# Altium project S7CAS-PLEIADES-CARTE-MERE_P06.PrjPcb (part 2 of 4)

## Sheet S7CAS-PLEIADES-CARTE-MERE_P06_FPGA2.SCHDOC
size Tabloid; SheetNumber: 7; SheetTotal: 18; Sheet_Name: FPGA2; Size: 11x17
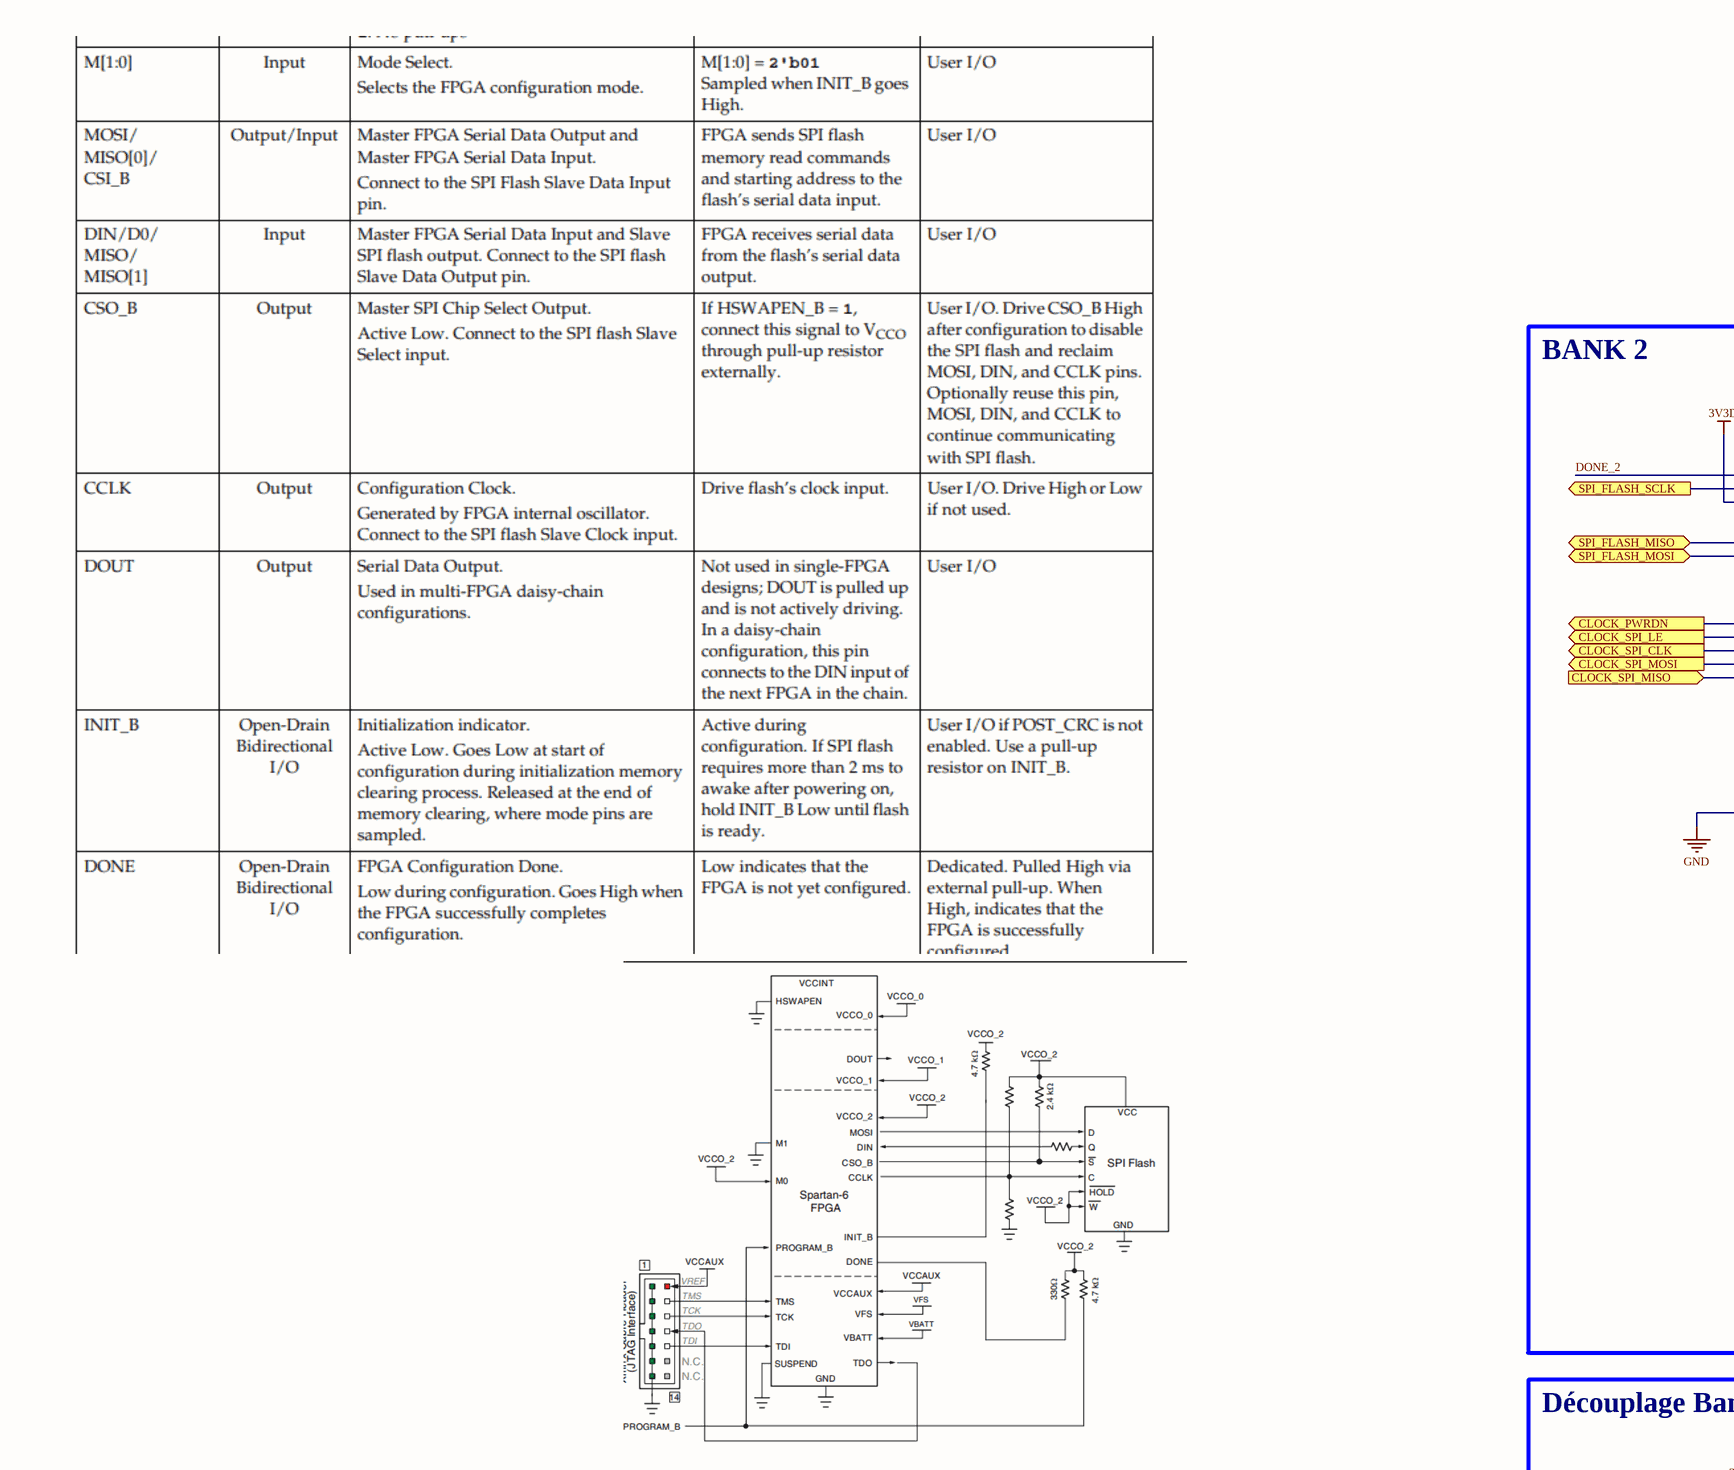
[diagram p11: S7CAS-PLEIADES-CARTE-MERE_P06_FPGA2.SCHDOC, top left]
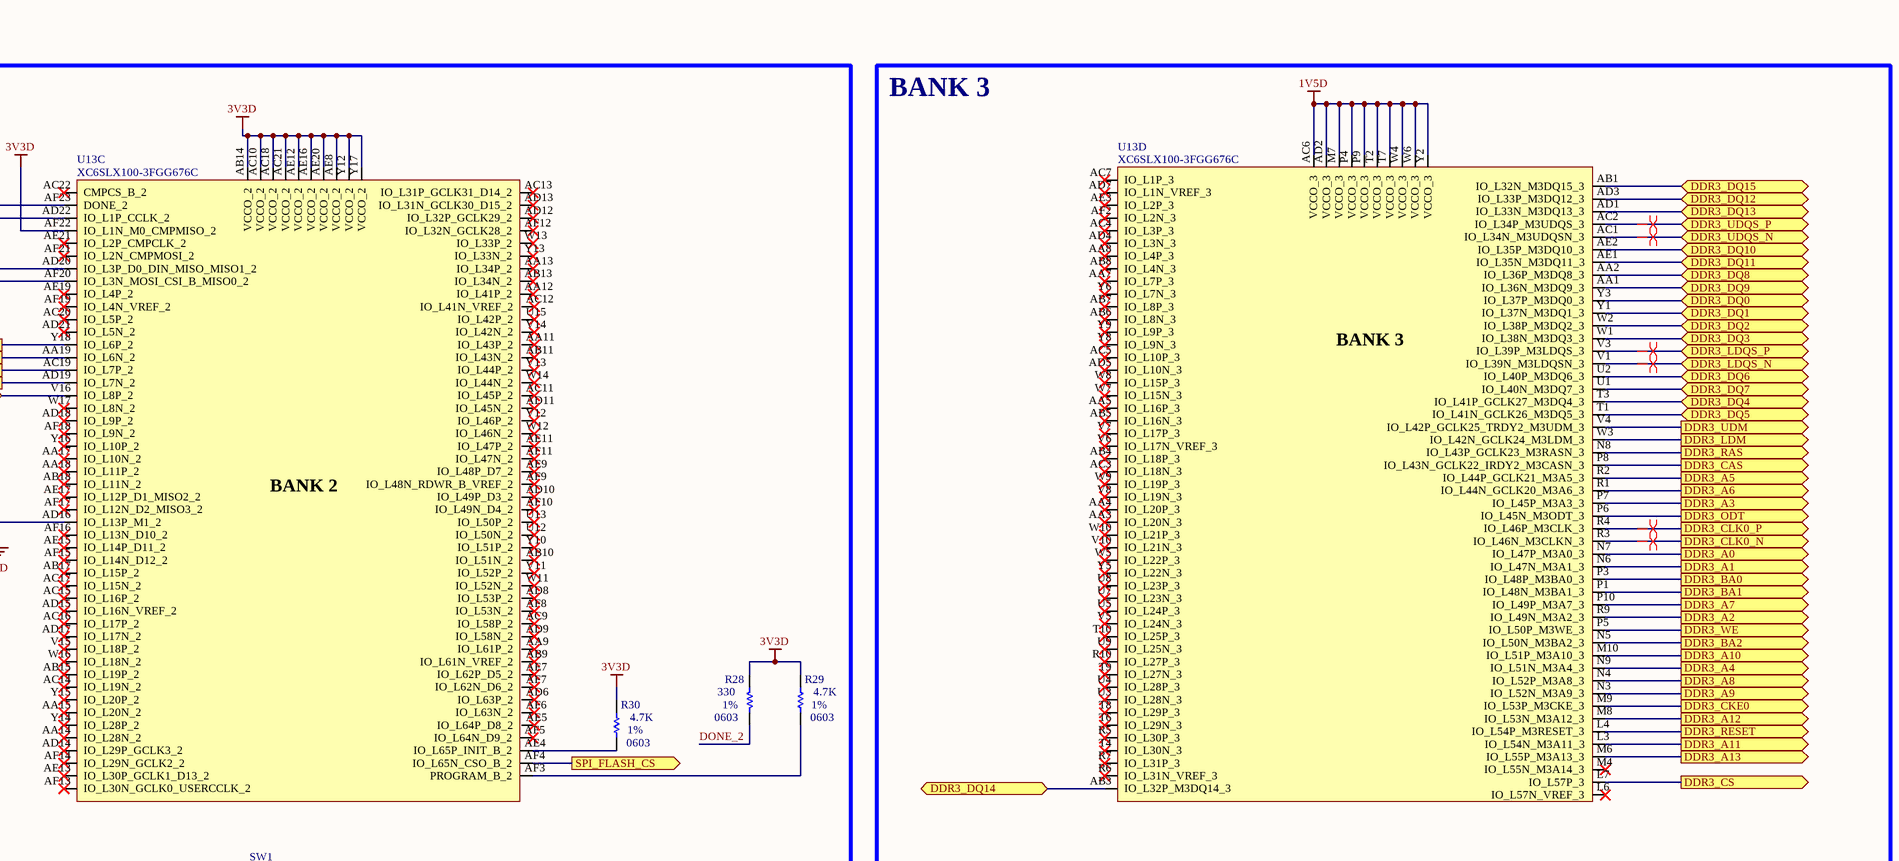
[diagram p12: S7CAS-PLEIADES-CARTE-MERE_P06_FPGA2.SCHDOC, top right]
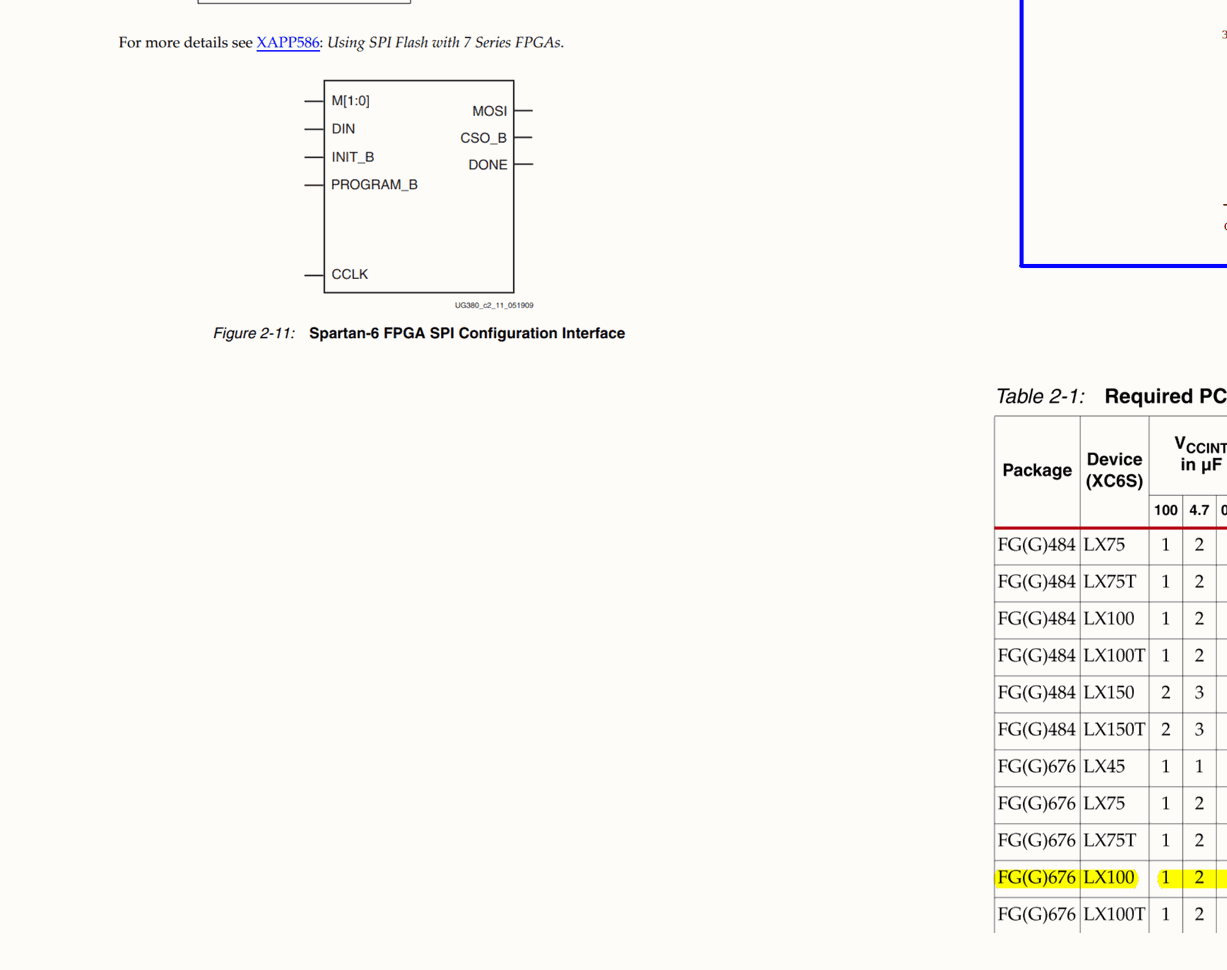
[diagram p13: S7CAS-PLEIADES-CARTE-MERE_P06_FPGA2.SCHDOC, bottom left]
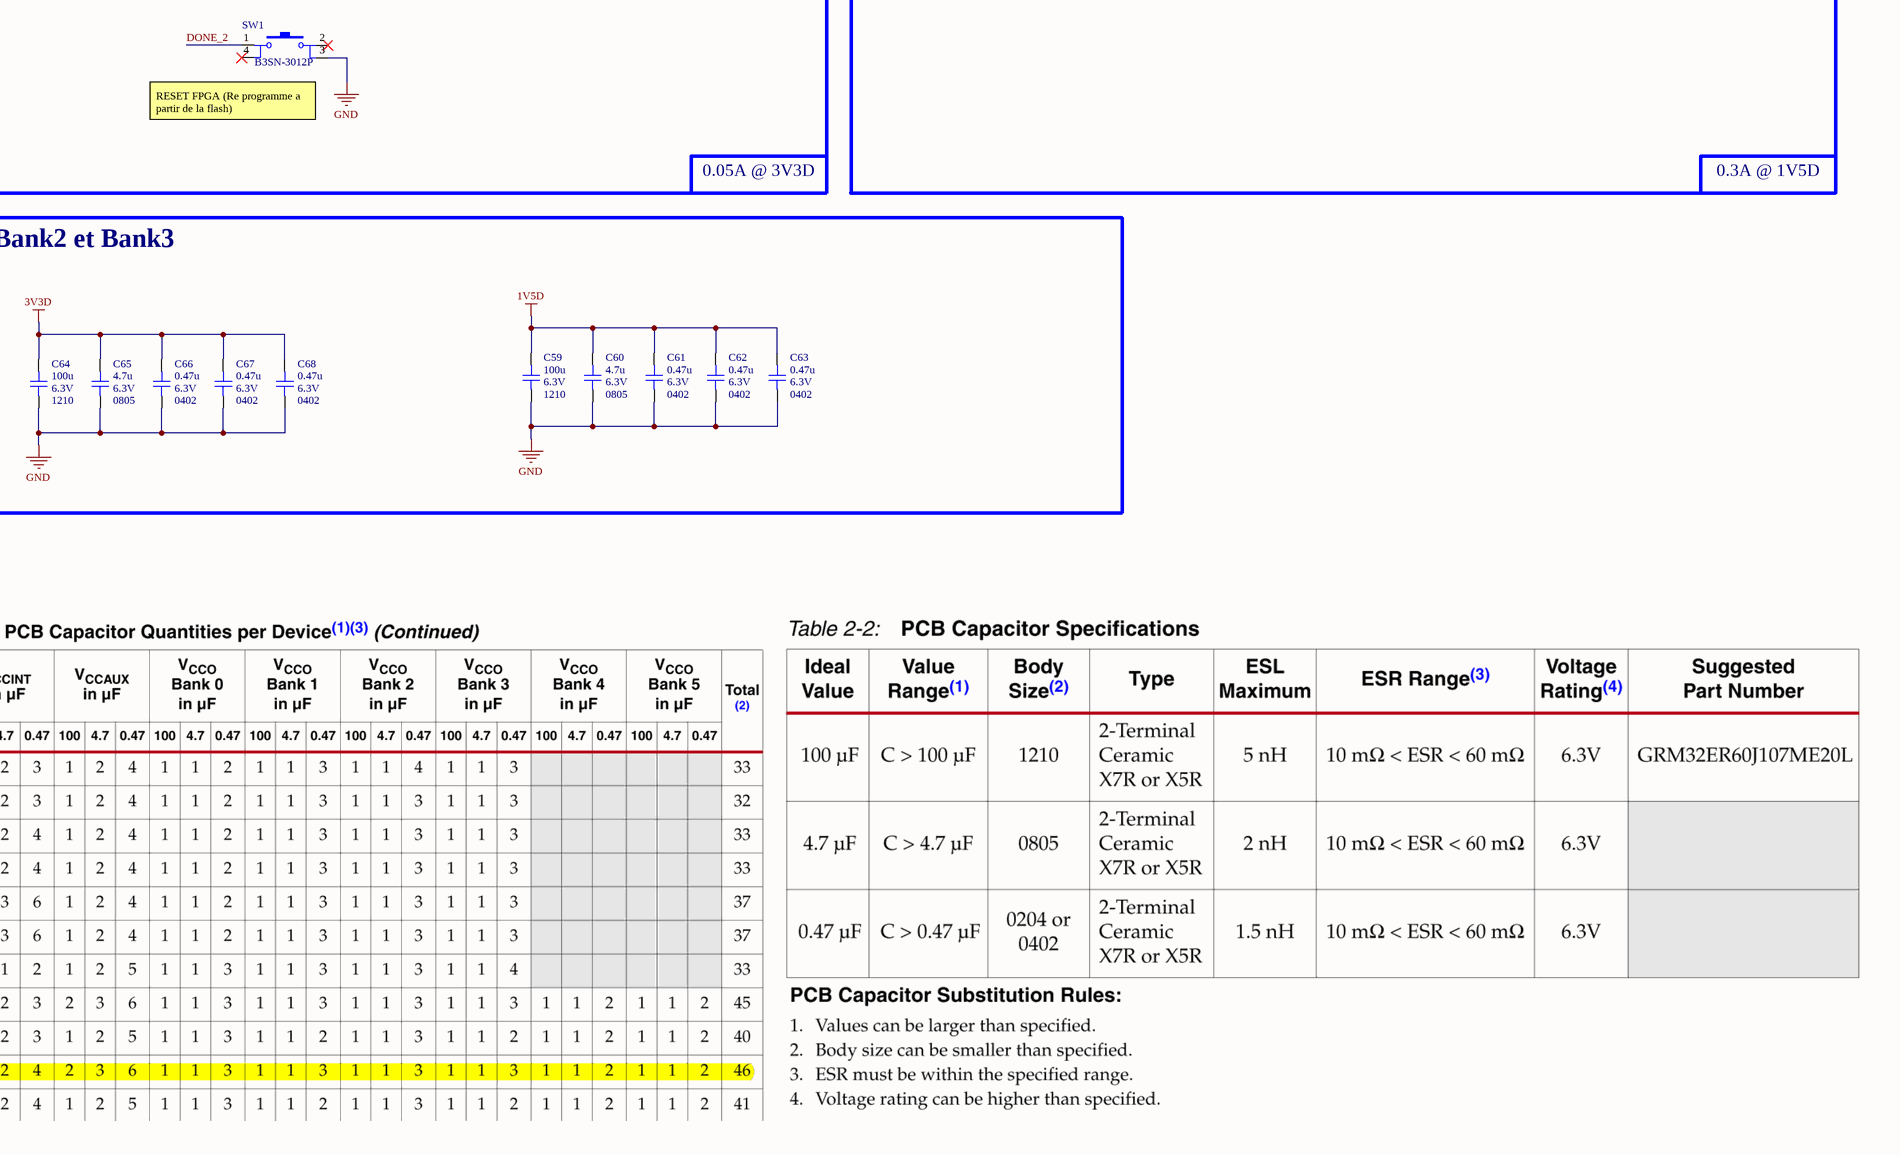
[diagram p14: S7CAS-PLEIADES-CARTE-MERE_P06_FPGA2.SCHDOC, bottom right]

### Parts
C59  value 100u  Voltage: 6.3V  Package: 1210  [CAP_1210]  (hidden comment: CAP - 1210)
C60  value 4.7u  Voltage: 6.3V  Package: 0805  [CAP_0805]  (hidden comment: CAP - 0805)
C61  value 0.47u  Voltage: 6.3V  Package: 0402  [CAP_0402]  (hidden comment: CAP - 0402)
C62  value 0.47u  Voltage: 6.3V  Package: 0402  [CAP_0402]  (hidden comment: CAP - 0402)
C63  value 0.47u  Voltage: 6.3V  Package: 0402  [CAP_0402]  (hidden comment: CAP - 0402)
C64  value 100u  Voltage: 6.3V  Package: 1210  [CAP_1210]  (hidden comment: CAP - 1210)
C65  value 4.7u  Voltage: 6.3V  Package: 0805  [CAP_0805]  (hidden comment: CAP - 0805)
C66  value 0.47u  Voltage: 6.3V  Package: 0402  [CAP_0402]  (hidden comment: CAP - 0402)
C67  value 0.47u  Voltage: 6.3V  Package: 0402  [CAP_0402]  (hidden comment: CAP - 0402)
C68  value 0.47u  Voltage: 6.3V  Package: 0402  [CAP_0402]  (hidden comment: CAP - 0402)
R28  value 330  Package: 0603  Precision: 1%  [RES_0603]  (hidden comment: RES - 0603)
R29  value 4.7K  Package: 0603  Precision: 1%  [RES_0603]  (hidden comment: RES - 0603)
R30  value 4.7K  Package: 0603  Precision: 1%  [RES_0603]  (hidden comment: RES - 0603)
SW1  B3SN-3012P  [SWI_TACT_B3SN-3012P]
U13  XC6SLX100-3FGG676C  [FPGA_XILINX_FGG676]  (parts C,D of 10)

### Blocks framed on the sheet
BANK 2: R28-R30 SW1 U13
BANK 3: U13
Découplage Bank2 et Bank3: C59-C68

### Ports
CLOCK_PWRDN (out, see S7CAS-PLEIADES-CARTE-MERE_P06_CLOCK[4B]), CLOCK_SPI_CLK (out, see S7CAS-PLEIADES-CARTE-MERE_P06_CLOCK[5B]), CLOCK_SPI_LE (out, see S7CAS-PLEIADES-CARTE-MERE_P06_CLOCK[5B]), CLOCK_SPI_MISO (in, see S7CAS-PLEIADES-CARTE-MERE_P06_CLOCK[5B]), CLOCK_SPI_MOSI (out, see S7CAS-PLEIADES-CARTE-MERE_P06_CLOCK[5B]), DDR3_A0 (out, see S7CAS-PLEIADES-CARTE-MERE_P06_DDR3[1B]), DDR3_A1 (out, see S7CAS-PLEIADES-CARTE-MERE_P06_DDR3[1B]), DDR3_A2 (out, see S7CAS-PLEIADES-CARTE-MERE_P06_DDR3[1B]), DDR3_A3 (out, see S7CAS-PLEIADES-CARTE-MERE_P06_DDR3[1B]), DDR3_A4 (out, see S7CAS-PLEIADES-CARTE-MERE_P06_DDR3[1B]), DDR3_A5 (out, see S7CAS-PLEIADES-CARTE-MERE_P06_DDR3[1B]), DDR3_A6 (out, see S7CAS-PLEIADES-CARTE-MERE_P06_DDR3[1B]), DDR3_A7 (out, see S7CAS-PLEIADES-CARTE-MERE_P06_DDR3[1B]), DDR3_A8 (out, see S7CAS-PLEIADES-CARTE-MERE_P06_DDR3[1B]), DDR3_A9 (out, see S7CAS-PLEIADES-CARTE-MERE_P06_DDR3[1B]), DDR3_A10 (out, see S7CAS-PLEIADES-CARTE-MERE_P06_DDR3[1B]), DDR3_A11 (out, see S7CAS-PLEIADES-CARTE-MERE_P06_DDR3[1B]), DDR3_A12 (out, see S7CAS-PLEIADES-CARTE-MERE_P06_DDR3[1B]), DDR3_A13 (out, see S7CAS-PLEIADES-CARTE-MERE_P06_DDR3[1B]), DDR3_BA0 (out, see S7CAS-PLEIADES-CARTE-MERE_P06_DDR3[1B]), DDR3_BA1 (out, see S7CAS-PLEIADES-CARTE-MERE_P06_DDR3[1B]), DDR3_BA2 (out, see S7CAS-PLEIADES-CARTE-MERE_P06_DDR3[1B]), DDR3_CAS (out, see S7CAS-PLEIADES-CARTE-MERE_P06_DDR3[1C]), DDR3_CKE0 (out, see S7CAS-PLEIADES-CARTE-MERE_P06_DDR3[1B]), DDR3_CLK0_N (out, see S7CAS-PLEIADES-CARTE-MERE_P06_DDR3[1B]), DDR3_CLK0_P (out, see S7CAS-PLEIADES-CARTE-MERE_P06_DDR3[1B]), DDR3_CS (out, see S7CAS-PLEIADES-CARTE-MERE_P06_DDR3[1C]), DDR3_DQ0 (bidir, see S7CAS-PLEIADES-CARTE-MERE_P06_DDR3[6B]), DDR3_DQ1 (bidir, see S7CAS-PLEIADES-CARTE-MERE_P06_DDR3[6B]), DDR3_DQ2 (bidir, see S7CAS-PLEIADES-CARTE-MERE_P06_DDR3[6B]), DDR3_DQ3 (bidir, see S7CAS-PLEIADES-CARTE-MERE_P06_DDR3[6B]), DDR3_DQ4 (bidir, see S7CAS-PLEIADES-CARTE-MERE_P06_DDR3[6B]), DDR3_DQ5 (bidir, see S7CAS-PLEIADES-CARTE-MERE_P06_DDR3[6B]), DDR3_DQ6 (bidir, see S7CAS-PLEIADES-CARTE-MERE_P06_DDR3[6B]), DDR3_DQ7 (bidir, see S7CAS-PLEIADES-CARTE-MERE_P06_DDR3[6B]), DDR3_DQ8 (bidir, see S7CAS-PLEIADES-CARTE-MERE_P06_DDR3[6B]), DDR3_DQ9 (bidir, see S7CAS-PLEIADES-CARTE-MERE_P06_DDR3[6B]), DDR3_DQ10 (bidir, see S7CAS-PLEIADES-CARTE-MERE_P06_DDR3[6B]), DDR3_DQ11 (bidir, see S7CAS-PLEIADES-CARTE-MERE_P06_DDR3[6B]), DDR3_DQ12 (bidir, see S7CAS-PLEIADES-CARTE-MERE_P06_DDR3[6B]), DDR3_DQ13 (bidir, see S7CAS-PLEIADES-CARTE-MERE_P06_DDR3[6B]), DDR3_DQ14 (bidir, see S7CAS-PLEIADES-CARTE-MERE_P06_DDR3[6B]), DDR3_DQ15 (bidir, see S7CAS-PLEIADES-CARTE-MERE_P06_DDR3[6B]), DDR3_LDM (out, see S7CAS-PLEIADES-CARTE-MERE_P06_DDR3[6B]), DDR3_LDQS_N (bidir, see S7CAS-PLEIADES-CARTE-MERE_P06_DDR3[6B]), DDR3_LDQS_P (bidir, see S7CAS-PLEIADES-CARTE-MERE_P06_DDR3[6B]), DDR3_ODT (out, see S7CAS-PLEIADES-CARTE-MERE_P06_DDR3[1C]), DDR3_RAS (out, see S7CAS-PLEIADES-CARTE-MERE_P06_DDR3[1C]), DDR3_RESET (out, see S7CAS-PLEIADES-CARTE-MERE_P06_DDR3[4A]), DDR3_UDM (out, see S7CAS-PLEIADES-CARTE-MERE_P06_DDR3[6B]), DDR3_UDQS_N (bidir, see S7CAS-PLEIADES-CARTE-MERE_P06_DDR3[6B]), DDR3_UDQS_P (bidir, see S7CAS-PLEIADES-CARTE-MERE_P06_DDR3[6B]), DDR3_WE (out, see S7CAS-PLEIADES-CARTE-MERE_P06_DDR3[1C]), SPI_FLASH_CS (out, see S7CAS-PLEIADES-CARTE-MERE_P06_FLASH[2A]), SPI_FLASH_MISO (bidir, see S7CAS-PLEIADES-CARTE-MERE_P06_FLASH[4A]), SPI_FLASH_MOSI (bidir, see S7CAS-PLEIADES-CARTE-MERE_P06_FLASH[4B]), SPI_FLASH_SCLK (out, see S7CAS-PLEIADES-CARTE-MERE_P06_FLASH[2A])

### Nets
1V5D: C59.2 C60.2 C61.2 C62.2 C63.2 U13.AC6(VCCO_3) U13.AD2(VCCO_3) U13.M7(VCCO_3) U13.P4(VCCO_3) U13.P9(VCCO_3) U13.T2(VCCO_3) U13.T7(VCCO_3) U13.W4(VCCO_3) U13.W6(VCCO_3) U13.Y2(VCCO_3)
3V3D: C64.2 C65.2 C66.2 C67.2 C68.2 R28.2 R29.2 R30.2 U13.AB14(VCCO_2) U13.AC10(VCCO_2) U13.AC18(VCCO_2) U13.AC21(VCCO_2) U13.AE8(VCCO_2) U13.AE12(VCCO_2) U13.AE16(VCCO_2) U13.AE20(VCCO_2) U13.AF22(IO_L1N_M0_CMPMISO_2) U13.Y12(VCCO_2) U13.Y17(VCCO_2)
GND: C59.1 C60.1 C61.1 C62.1 C63.1 C64.1 C65.1 C66.1 C67.1 C68.1 SW1.3 U13.AD16(IO_L13P_M1_2)
CLOCK_PWRDN: U13.Y18(IO_L6P_2) ; port CLOCK_PWRDN
CLOCK_SPI_CLK: U13.AC19(IO_L7P_2) ; port CLOCK_SPI_CLK
CLOCK_SPI_LE: U13.AA19(IO_L6N_2) ; port CLOCK_SPI_LE
CLOCK_SPI_MISO: U13.V16(IO_L8P_2) ; port CLOCK_SPI_MISO
CLOCK_SPI_MOSI: U13.AD19(IO_L7N_2) ; port CLOCK_SPI_MOSI
DDR3_A0: U13.N7(IO_L47P_M3A0_3) ; port DDR3_A0
DDR3_A1: U13.N6(IO_L47N_M3A1_3) ; port DDR3_A1
DDR3_A2: U13.R9(IO_L49N_M3A2_3) ; port DDR3_A2
DDR3_A3: U13.P7(IO_L45P_M3A3_3) ; port DDR3_A3
DDR3_A4: U13.N9(IO_L51N_M3A4_3) ; port DDR3_A4
DDR3_A5: U13.R2(IO_L44P_GCLK21_M3A5_3) ; port DDR3_A5
DDR3_A6: U13.R1(IO_L44N_GCLK20_M3A6_3) ; port DDR3_A6
DDR3_A7: U13.P10(IO_L49P_M3A7_3) ; port DDR3_A7
DDR3_A8: U13.N4(IO_L52P_M3A8_3) ; port DDR3_A8
DDR3_A9: U13.N3(IO_L52N_M3A9_3) ; port DDR3_A9
DDR3_A10: U13.M10(IO_L51P_M3A10_3) ; port DDR3_A10
DDR3_A11: U13.L3(IO_L54N_M3A11_3) ; port DDR3_A11
DDR3_A12: U13.M8(IO_L53N_M3A12_3) ; port DDR3_A12
DDR3_A13: U13.M6(IO_L55P_M3A13_3) ; port DDR3_A13
DDR3_BA0: U13.P3(IO_L48P_M3BA0_3) ; port DDR3_BA0
DDR3_BA1: U13.P1(IO_L48N_M3BA1_3) ; port DDR3_BA1
DDR3_BA2: U13.N5(IO_L50N_M3BA2_3) ; port DDR3_BA2
DDR3_CAS: U13.P8(IO_L43N_GCLK22_IRDY2_M3CASN_3) ; port DDR3_CAS
DDR3_CKE0: U13.M9(IO_L53P_M3CKE_3) ; port DDR3_CKE0
DDR3_CLK0_N: U13.R3(IO_L46N_M3CLKN_3) ; port DDR3_CLK0_N
DDR3_CLK0_P: U13.R4(IO_L46P_M3CLK_3) ; port DDR3_CLK0_P
DDR3_CS: U13.L7(IO_L57P_3) ; port DDR3_CS
DDR3_DQ0: U13.Y3(IO_L37P_M3DQ0_3) ; port DDR3_DQ0
DDR3_DQ1: U13.Y1(IO_L37N_M3DQ1_3) ; port DDR3_DQ1
DDR3_DQ2: U13.W2(IO_L38P_M3DQ2_3) ; port DDR3_DQ2
DDR3_DQ3: U13.W1(IO_L38N_M3DQ3_3) ; port DDR3_DQ3
DDR3_DQ4: U13.T3(IO_L41P_GCLK27_M3DQ4_3) ; port DDR3_DQ4
DDR3_DQ5: U13.T1(IO_L41N_GCLK26_M3DQ5_3) ; port DDR3_DQ5
DDR3_DQ6: U13.U2(IO_L40P_M3DQ6_3) ; port DDR3_DQ6
DDR3_DQ7: U13.U1(IO_L40N_M3DQ7_3) ; port DDR3_DQ7
DDR3_DQ8: U13.AA2(IO_L36P_M3DQ8_3) ; port DDR3_DQ8
DDR3_DQ9: U13.AA1(IO_L36N_M3DQ9_3) ; port DDR3_DQ9
DDR3_DQ10: U13.AE2(IO_L35P_M3DQ10_3) ; port DDR3_DQ10
DDR3_DQ11: U13.AE1(IO_L35N_M3DQ11_3) ; port DDR3_DQ11
DDR3_DQ12: U13.AD3(IO_L33P_M3DQ12_3) ; port DDR3_DQ12
DDR3_DQ13: U13.AD1(IO_L33N_M3DQ13_3) ; port DDR3_DQ13
DDR3_DQ14: U13.AB3(IO_L32P_M3DQ14_3) ; port DDR3_DQ14
DDR3_DQ15: U13.AB1(IO_L32N_M3DQ15_3) ; port DDR3_DQ15
DDR3_LDM: U13.W3(IO_L42N_GCLK24_M3LDM_3) ; port DDR3_LDM
DDR3_LDQS_N: U13.V1(IO_L39N_M3LDQSN_3) ; port DDR3_LDQS_N
DDR3_LDQS_P: U13.V3(IO_L39P_M3LDQS_3) ; port DDR3_LDQS_P
DDR3_ODT: U13.P6(IO_L45N_M3ODT_3) ; port DDR3_ODT
DDR3_RAS: U13.N8(IO_L43P_GCLK23_M3RASN_3) ; port DDR3_RAS
DDR3_RESET: U13.L4(IO_L54P_M3RESET_3) ; port DDR3_RESET
DDR3_UDM: U13.V4(IO_L42P_GCLK25_TRDY2_M3UDM_3) ; port DDR3_UDM
DDR3_UDQS_N: U13.AC1(IO_L34N_M3UDQSN_3) ; port DDR3_UDQS_N
DDR3_UDQS_P: U13.AC2(IO_L34P_M3UDQS_3) ; port DDR3_UDQS_P
DDR3_WE: U13.P5(IO_L50P_M3WE_3) ; port DDR3_WE
DONE_2: R28.1 SW1.1 U13.AF23(DONE_2)
SPI_FLASH_CS: U13.AF4(IO_L65N_CSO_B_2) ; port SPI_FLASH_CS
SPI_FLASH_MISO: U13.AD20(IO_L3P_D0_DIN_MISO_MISO1_2) ; port SPI_FLASH_MISO
SPI_FLASH_MOSI: U13.AF20(IO_L3N_MOSI_CSI_B_MISO0_2) ; port SPI_FLASH_MOSI
SPI_FLASH_SCLK: U13.AD22(IO_L1P_CCLK_2) ; port SPI_FLASH_SCLK
NetR29_1: R29.1 U13.AF3(PROGRAM_B_2)
NetR30_1: R30.1 U13.AE4(IO_L65P_INIT_B_2)

Not connected (* = marked no-connect by the designer): SW1 2* 4*; U13 AA3(IO_L20N_3)* AA4(IO_L20P_3)* AA5(IO_L16P_3)* AA7(IO_L7P_3)* AA8(IO_L4P_3)* AA9(IO_L61P_2)* AA11(IO_L43P_2)* AA12(IO_L41P_2)* AA13(IO_L34P_2)* AA14(IO_L28N_2)* AA15(IO_L20N_2)* AA17(IO_L10N_2)* AA18(IO_L11P_2)* AB4(IO_L18P_3)* AB5(IO_L16N_3)* AB6(IO_L8N_3)* AB7(IO_L8P_3)* AB8(IO_L4N_3)* AB9(IO_L61N_VREF_2)* AB10(IO_L51N_2)* AB11(IO_L43N_2)* AB13(IO_L34N_2)* AB15(IO_L19P_2)* AB17(IO_L15P_2)* AB18(IO_L11N_2)* AC3(IO_L18N_3)* AC4(IO_L3P_3)* AC5(IO_L10P_3)* AC7(IO_L1P_3)* AC9(IO_L58P_2)* AC11(IO_L45P_2)* AC12(IO_L41N_VREF_2)* AC13(IO_L31P_GCLK31_D14_2)* AC14(IO_L19N_2)* AC15(IO_L16P_2)* AC16(IO_L17P_2)* AC17(IO_L15N_2)* AC20(IO_L5P_2)* AC22(CMPCS_B_2)* AD4(IO_L3N_3)* AD5(IO_L10N_3)* AD6(IO_L63P_2)* AD7(IO_L1N_VREF_3)* AD8(IO_L53P_2)* AD9(IO_L58N_2)* AD10(IO_L49P_D3_2)* AD11(IO_L45N_2)* AD12(IO_L32P_GCLK29_2)* AD13(IO_L31N_GCLK30_D15_2)* AD14(IO_L29P_GCLK3_2)* AD15(IO_L16N_VREF_2)* AD17(IO_L17N_2)* AD18(IO_L9P_2)* AD21(IO_L5N_2)* AE3(IO_L2P_3)* AE5(IO_L64P_D8_2)* AE7(IO_L62P_D5_2)* AE9(IO_L48P_D7_2)* AE11(IO_L47P_2)* AE13(IO_L30P_GCLK1_D13_2)* AE15(IO_L14P_D11_2)* AE17(IO_L12P_D1_MISO2_2)* AE19(IO_L4P_2)* AE21(IO_L2P_CMPCLK_2)* AF2(IO_L2N_3)* AF5(IO_L64N_D9_2)* AF6(IO_L63N_2)* AF7(IO_L62N_D6_2)* AF8(IO_L53N_2)* AF9(IO_L48N_RDWR_B_VREF_2)* AF10(IO_L49N_D4_2)* AF11(IO_L47N_2)* AF12(IO_L32N_GCLK28_2)* AF13(IO_L30N_GCLK0_USERCCLK_2)* AF14(IO_L29N_GCLK2_2)* AF15(IO_L14N_D12_2)* AF16(IO_L13N_D10_2)* AF17(IO_L12N_D2_MISO3_2)* AF18(IO_L9N_2)* AF19(IO_L4N_VREF_2)* AF21(IO_L2N_CMPMOSI_2)* L6(IO_L57N_VREF_3)* M4(IO_L55N_M3A14_3)* R5(IO_L30P_3)* R6(IO_L31N_VREF_3)* R7(IO_L31P_3)* R10(IO_L27P_3)* T4(IO_L30N_3)* T6(IO_L29N_3)* T8(IO_L29P_3)* T9(IO_L27N_3)* T10(IO_L25P_3)* U3(IO_L28N_3)* U4(IO_L28P_3)* U5(IO_L24P_3)* U7(IO_L23N_3)* U8(IO_L23P_3)* U9(IO_L25N_3)* U12(IO_L50N_2)* U13(IO_L50P_2)* U15(IO_L42P_2)* V5(IO_L24N_3)* V6(IO_L17N_VREF_3)* V7(IO_L17P_3)* V8(IO_L19N_3)* V10(IO_L21N_3)* V11(IO_L52P_2)* V12(IO_L46P_2)* V13(IO_L44P_2)* V14(IO_L42N_2)* V15(IO_L18P_2)* W5(IO_L22P_3)* W7(IO_L15N_3)* W8(IO_L15P_3)* W9(IO_L19P_3)* W10(IO_L21P_3)* W11(IO_L52N_2)* W12(IO_L46N_2)* W13(IO_L33P_2)* W14(IO_L44N_2)* W16(IO_L18N_2)* W17(IO_L8N_2)* Y5(IO_L22N_3)* Y6(IO_L7N_3)* Y8(IO_L9N_3)* Y9(IO_L9P_3)* Y10(IO_L51P_2)* Y13(IO_L33N_2)* Y14(IO_L28P_2)* Y15(IO_L20P_2)* Y16(IO_L10P_2)*

### Layout directives
differential pair: DDR3_CLK0_N, DDR3_CLK0_P, DDR3_LDQS_N, DDR3_LDQS_P, DDR3_UDQS_N, DDR3_UDQS_P

### Notes on the sheet
- (near SW1) RESET FPGA (Re programme a partir de la flash)
- 0.05A @ 3V3D
- 0.3A @ 1V5D
- Sheet Name
- Project Title
- Global Project
- Size
- Group
- Revision
- Date
- Sheet
- of
- Filename
- Designers
- (in symbol FPGA_XC6SLX100-3FGG676C, part C) BANK 2
- (in symbol FPGA_XC6SLX100-3FGG676C, part D) BANK 3

### Library data of the parts
C59 C64 = CAP - 1210: Precision: 10%; Current: *; CreatedBy: Jonathan Bouchard; Power: *
C60 C65 = CAP - 0805: Precision: 10%; Current: *; CreatedBy: Jonathan Bouchard; Power: *
C61-C63 C66-C68 = CAP - 0402: Precision: 10%; Current: *; CreatedBy: Jonathan Bouchard; Power: *
SW1 = SWI_TACT_B3SN-3012P: SWI - TACT SPST-NO 0.05A 24V - 4-SMD; Current: 50mA; Mfg: Omron; Mfg Part Number: B3SN-3012P; HelpURL: http://www.omron.com/ecb/products/pdf/en-b3sn.pdf; CreatedBy: Jonathan Bouchard; Temperature: -25°C ~ 70°C; Power: *; Precision: *; Package: 4-SMD; Value: *; Voltage: 24V; Supplier 1: Digikey; Supplier Part Number 1: SW261CT-ND
U13 = FPGA_XC6SLX100-3FGG676C: as U13 on sheet S7CAS-PLEIADES-CARTE-MERE_P06_FPGA1; Current: *; Power: *; Mfg: Xilinx; Mfg Part Number: XC6SLX100-3FGG676C; HelpURL: https://www.xilinx.com/support/documentation/data_sheets/ds162.pdf; CreatedBy: Jonathan Bouchard; Temperature: 0°C ~ 85°C (TJ); Value: *; Precision: *; Package: BGA-676; Supplier 1: Digikey; Supplier Part Number 1: 122-1760-ND
R28-R30 = RES - 0603: Current: *; CreatedBy: Jonathan Bouchard

## Sheet S7CAS-PLEIADES-CARTE-MERE_P06_FPGA3.SCHDOC
size Tabloid; SheetNumber: 8; SheetTotal: 18; Sheet_Name: FPGA3; Size: 11x17
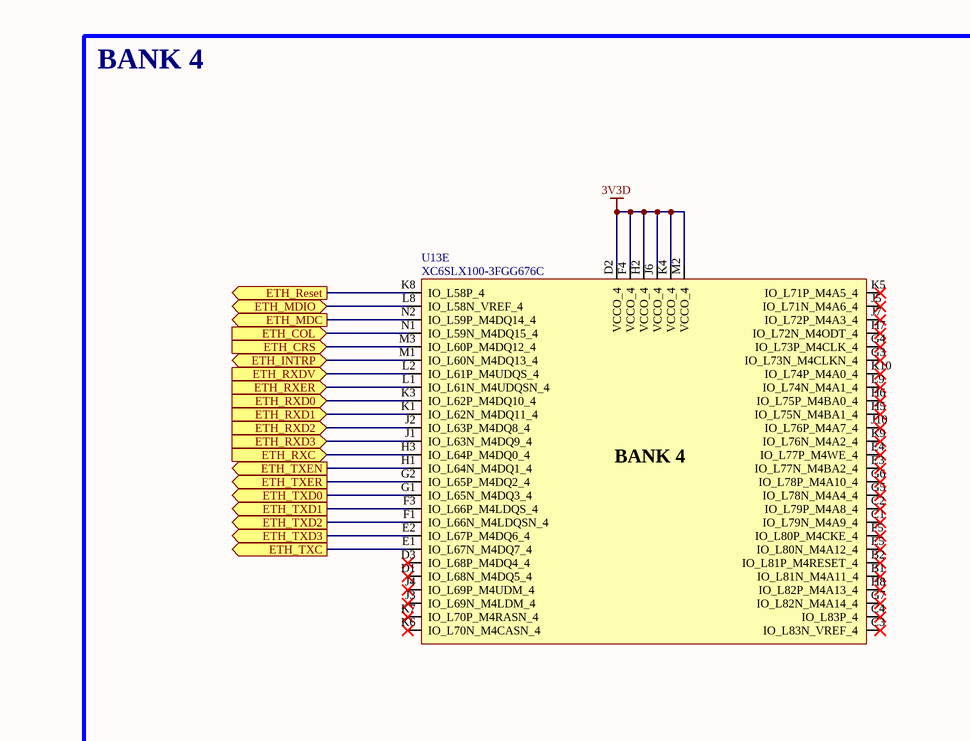
[diagram p15: S7CAS-PLEIADES-CARTE-MERE_P06_FPGA3.SCHDOC, top left]
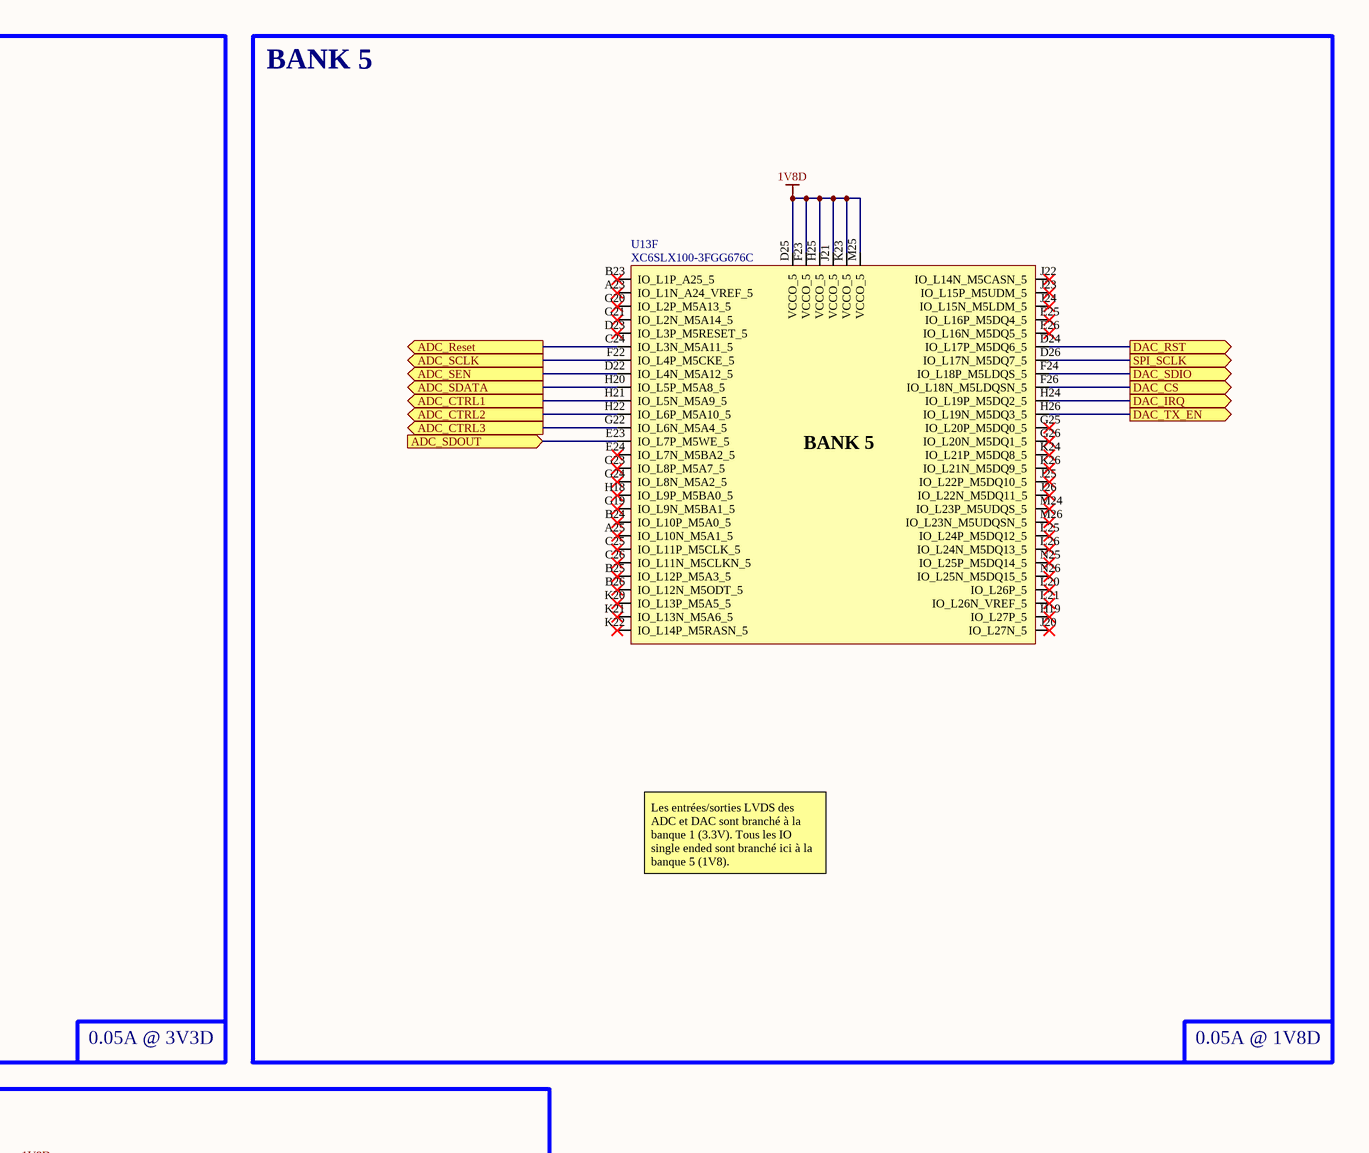
[diagram p16: S7CAS-PLEIADES-CARTE-MERE_P06_FPGA3.SCHDOC, top right]
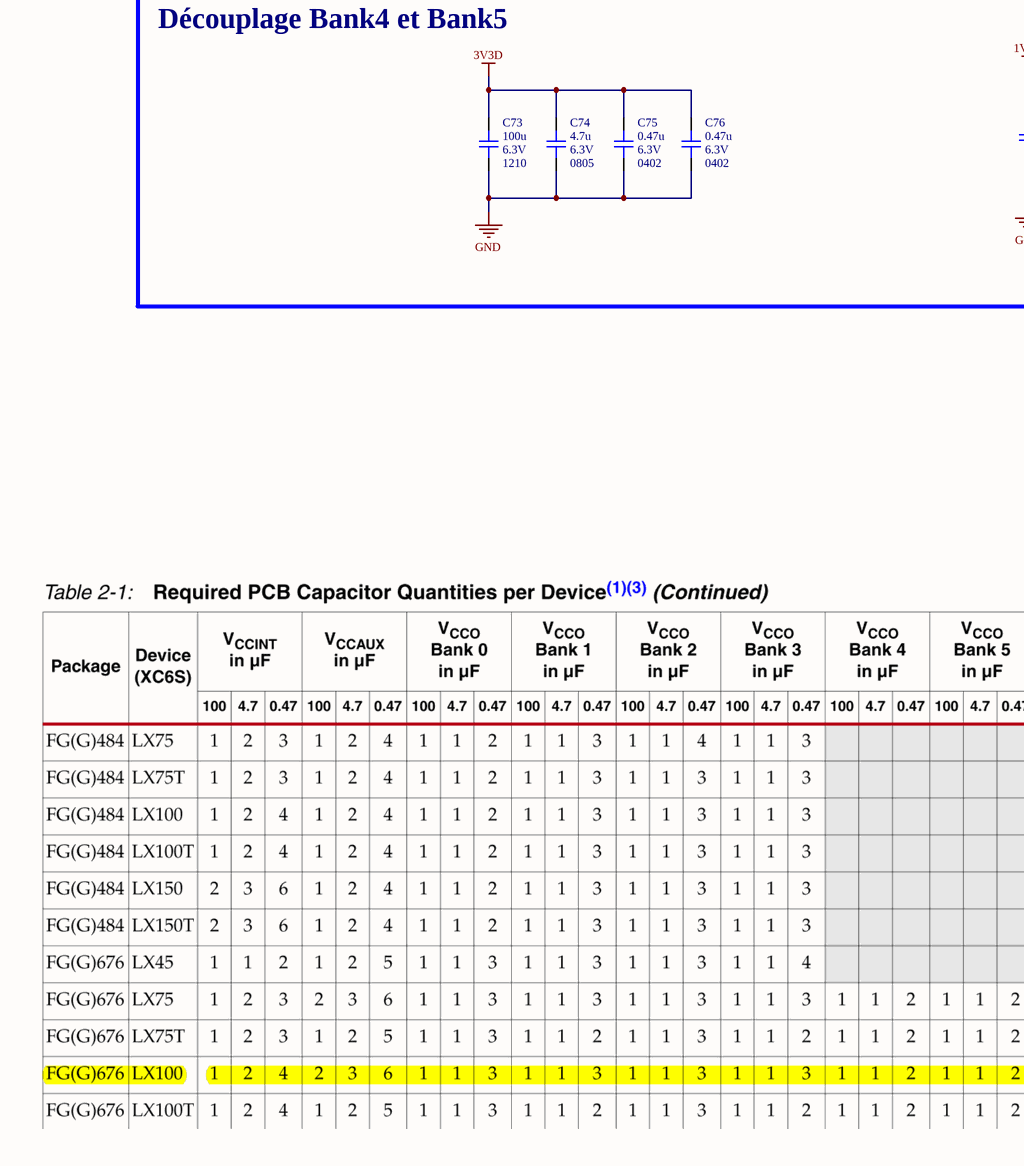
[diagram p17: S7CAS-PLEIADES-CARTE-MERE_P06_FPGA3.SCHDOC, bottom left]
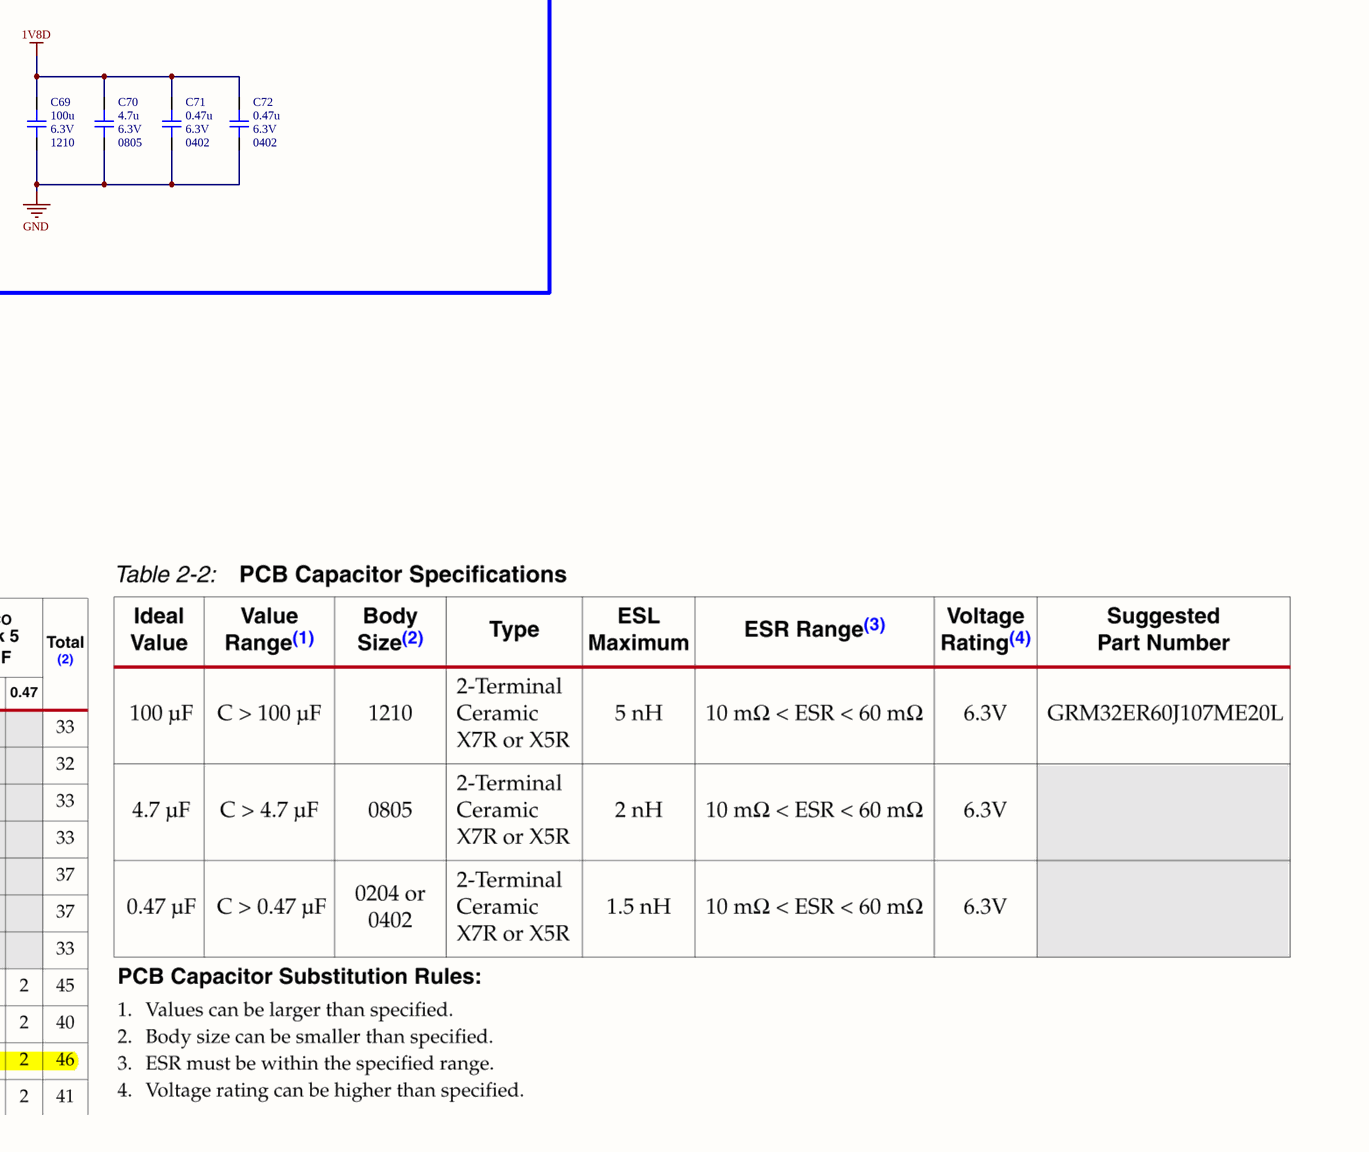
[diagram p18: S7CAS-PLEIADES-CARTE-MERE_P06_FPGA3.SCHDOC, bottom right]

### Parts
C69  value 100u  Voltage: 6.3V  Package: 1210  [CAP_1210]  (hidden comment: CAP - 1210)
C70  value 4.7u  Voltage: 6.3V  Package: 0805  [CAP_0805]  (hidden comment: CAP - 0805)
C71  value 0.47u  Voltage: 6.3V  Package: 0402  [CAP_0402]  (hidden comment: CAP - 0402)
C72  value 0.47u  Voltage: 6.3V  Package: 0402  [CAP_0402]  (hidden comment: CAP - 0402)
C73  value 100u  Voltage: 6.3V  Package: 1210  [CAP_1210]  (hidden comment: CAP - 1210)
C74  value 4.7u  Voltage: 6.3V  Package: 0805  [CAP_0805]  (hidden comment: CAP - 0805)
C75  value 0.47u  Voltage: 6.3V  Package: 0402  [CAP_0402]  (hidden comment: CAP - 0402)
C76  value 0.47u  Voltage: 6.3V  Package: 0402  [CAP_0402]  (hidden comment: CAP - 0402)
U13  XC6SLX100-3FGG676C  [FPGA_XILINX_FGG676]  (parts E,F of 10)

### Blocks framed on the sheet
BANK 4: U13
BANK 5: U13
Découplage Bank4 et Bank5: C69-C76

### Ports
ADC_CTRL1 (out, see S7CAS-PLEIADES-CARTE-MERE_P06_ADC[5A]), ADC_CTRL2 (out, see S7CAS-PLEIADES-CARTE-MERE_P06_ADC[5A]), ADC_CTRL3 (out, see S7CAS-PLEIADES-CARTE-MERE_P06_ADC[5A]), ADC_Reset (out, see S7CAS-PLEIADES-CARTE-MERE_P06_ADC[5A]), ADC_SCLK (out, see S7CAS-PLEIADES-CARTE-MERE_P06_ADC[5A]), ADC_SDATA (out, see S7CAS-PLEIADES-CARTE-MERE_P06_ADC[5A]), ADC_SDOUT (in, see S7CAS-PLEIADES-CARTE-MERE_P06_ADC[6A]), ADC_SEN (out, see S7CAS-PLEIADES-CARTE-MERE_P06_ADC[5A]), DAC_CS (out, see S7CAS-PLEIADES-CARTE-MERE_P06_DAC[5A]), DAC_IRQ (out, see S7CAS-PLEIADES-CARTE-MERE_P06_DAC[5A]), DAC_RST (out, see S7CAS-PLEIADES-CARTE-MERE_P06_DAC[5A]), DAC_SDIO (out, see S7CAS-PLEIADES-CARTE-MERE_P06_DAC[5A]), DAC_TX_EN (out, see S7CAS-PLEIADES-CARTE-MERE_P06_DAC[5B]), ETH_COL (in, see S7CAS-PLEIADES-CARTE-MERE_P06_ETHERNET[2B]), ETH_CRS (in, see S7CAS-PLEIADES-CARTE-MERE_P06_ETHERNET[2B]), ETH_INTRP (bidir, see S7CAS-PLEIADES-CARTE-MERE_P06_ETHERNET[1B]), ETH_MDC (out, see S7CAS-PLEIADES-CARTE-MERE_P06_ETHERNET[2A]), ETH_MDIO (bidir, see S7CAS-PLEIADES-CARTE-MERE_P06_ETHERNET[1A]), ETH_Reset (out, see S7CAS-PLEIADES-CARTE-MERE_P06_ETHERNET[2A]), ETH_RXC (in, see S7CAS-PLEIADES-CARTE-MERE_P06_ETHERNET[2B]), ETH_RXD0 (in, see S7CAS-PLEIADES-CARTE-MERE_P06_ETHERNET[2B]), ETH_RXD1 (in, see S7CAS-PLEIADES-CARTE-MERE_P06_ETHERNET[2B]), ETH_RXD2 (in, see S7CAS-PLEIADES-CARTE-MERE_P06_ETHERNET[2B]), ETH_RXD3 (in, see S7CAS-PLEIADES-CARTE-MERE_P06_ETHERNET[2B]), ETH_RXDV (in, see S7CAS-PLEIADES-CARTE-MERE_P06_ETHERNET[2B]), ETH_RXER (in, see S7CAS-PLEIADES-CARTE-MERE_P06_ETHERNET[2B]), ETH_TXC (out, see S7CAS-PLEIADES-CARTE-MERE_P06_ETHERNET[2B]), ETH_TXD0 (out, see S7CAS-PLEIADES-CARTE-MERE_P06_ETHERNET[2B]), ETH_TXD1 (out, see S7CAS-PLEIADES-CARTE-MERE_P06_ETHERNET[2B]), ETH_TXD2 (out, see S7CAS-PLEIADES-CARTE-MERE_P06_ETHERNET[2B]), ETH_TXD3 (out, see S7CAS-PLEIADES-CARTE-MERE_P06_ETHERNET[2B]), ETH_TXEN (out, see S7CAS-PLEIADES-CARTE-MERE_P06_ETHERNET[2B]), ETH_TXER (out, see S7CAS-PLEIADES-CARTE-MERE_P06_ETHERNET[2B]), SPI_SCLK (out, see S7CAS-PLEIADES-CARTE-MERE_P06_DAC[5A])

### Nets
1V8D: C69.2 C70.2 C71.2 C72.2 U13.D25(VCCO_5) U13.F23(VCCO_5) U13.H25(VCCO_5) U13.J21(VCCO_5) U13.K23(VCCO_5) U13.M25(VCCO_5)
3V3D: C73.2 C74.2 C75.2 C76.2 U13.D2(VCCO_4) U13.F4(VCCO_4) U13.H2(VCCO_4) U13.J6(VCCO_4) U13.K4(VCCO_4) U13.M2(VCCO_4)
GND: C69.1 C70.1 C71.1 C72.1 C73.1 C74.1 C75.1 C76.1
ADC_CTRL1: U13.H21(IO_L5N_M5A9_5) ; port ADC_CTRL1
ADC_CTRL2: U13.H22(IO_L6P_M5A10_5) ; port ADC_CTRL2
ADC_CTRL3: U13.G22(IO_L6N_M5A4_5) ; port ADC_CTRL3
ADC_Reset: U13.C24(IO_L3N_M5A11_5) ; port ADC_Reset
ADC_SCLK: U13.F22(IO_L4P_M5CKE_5) ; port ADC_SCLK
ADC_SDATA: U13.H20(IO_L5P_M5A8_5) ; port ADC_SDATA
ADC_SDOUT: U13.E23(IO_L7P_M5WE_5) ; port ADC_SDOUT
ADC_SEN: U13.D22(IO_L4N_M5A12_5) ; port ADC_SEN
DAC_CS: U13.F26(IO_L18N_M5LDQSN_5) ; port DAC_CS
DAC_IRQ: U13.H24(IO_L19P_M5DQ2_5) ; port DAC_IRQ
DAC_RST: U13.D24(IO_L17P_M5DQ6_5) ; port DAC_RST
DAC_SDIO: U13.F24(IO_L18P_M5LDQS_5) ; port DAC_SDIO
DAC_TX_EN: U13.H26(IO_L19N_M5DQ3_5) ; port DAC_TX_EN
ETH_COL: U13.N1(IO_L59N_M4DQ15_4) ; port ETH_COL
ETH_CRS: U13.M3(IO_L60P_M4DQ12_4) ; port ETH_CRS
ETH_INTRP: U13.M1(IO_L60N_M4DQ13_4) ; port ETH_INTRP
ETH_MDC: U13.N2(IO_L59P_M4DQ14_4) ; port ETH_MDC
ETH_MDIO: U13.L8(IO_L58N_VREF_4) ; port ETH_MDIO
ETH_Reset: U13.K8(IO_L58P_4) ; port ETH_Reset
ETH_RXC: U13.H3(IO_L64P_M4DQ0_4) ; port ETH_RXC
ETH_RXD0: U13.K3(IO_L62P_M4DQ10_4) ; port ETH_RXD0
ETH_RXD1: U13.K1(IO_L62N_M4DQ11_4) ; port ETH_RXD1
ETH_RXD2: U13.J2(IO_L63P_M4DQ8_4) ; port ETH_RXD2
ETH_RXD3: U13.J1(IO_L63N_M4DQ9_4) ; port ETH_RXD3
ETH_RXDV: U13.L2(IO_L61P_M4UDQS_4) ; port ETH_RXDV
ETH_RXER: U13.L1(IO_L61N_M4UDQSN_4) ; port ETH_RXER
ETH_TXC: U13.E1(IO_L67N_M4DQ7_4) ; port ETH_TXC
ETH_TXD0: U13.G1(IO_L65N_M4DQ3_4) ; port ETH_TXD0
ETH_TXD1: U13.F3(IO_L66P_M4LDQS_4) ; port ETH_TXD1
ETH_TXD2: U13.F1(IO_L66N_M4LDQSN_4) ; port ETH_TXD2
ETH_TXD3: U13.E2(IO_L67P_M4DQ6_4) ; port ETH_TXD3
ETH_TXEN: U13.H1(IO_L64N_M4DQ1_4) ; port ETH_TXEN
ETH_TXER: U13.G2(IO_L65P_M4DQ2_4) ; port ETH_TXER
SPI_SCLK: U13.D26(IO_L17N_M5DQ7_5) ; port SPI_SCLK

Not connected (* = marked no-connect by the designer): U13 A23(IO_L1N_A24_VREF_5)* A25(IO_L10N_M5A1_5)* B1(IO_L81N_M4A11_4)* B2(IO_L81P_M4RESET_4)* B23(IO_L1P_A25_5)* B24(IO_L10P_M5A0_5)* B25(IO_L12P_M5A3_5)* B26(IO_L12N_M5ODT_5)* C1(IO_L79N_M4A9_4)* C2(IO_L79P_M4A8_4)* C3(IO_L83N_VREF_4)* C4(IO_L83P_4)* C25(IO_L11P_M5CLK_5)* C26(IO_L11N_M5CLKN_5)* D1(IO_L68N_M4DQ5_4)* D3(IO_L68P_M4DQ4_4)* D23(IO_L3P_M5RESET_5)* E3(IO_L77N_M4BA2_4)* E4(IO_L77P_M4WE_4)* E5(IO_L80N_M4A12_4)* E24(IO_L7N_M5BA2_5)* E25(IO_L16P_M5DQ4_5)* E26(IO_L16N_M5DQ5_5)* F5(IO_L80P_M4CKE_4)* G3(IO_L73N_M4CLKN_4)* G4(IO_L73P_M4CLK_4)* G5(IO_L78N_M4A4_4)* G6(IO_L78P_M4A10_4)* G7(IO_L82N_M4A14_4)* G19(IO_L9N_M5BA1_5)* G20(IO_L2P_M5A13_5)* G21(IO_L2N_M5A14_5)* G23(IO_L8P_M5A7_5)* G24(IO_L8N_M5A2_5)* G25(IO_L20P_M5DQ0_5)* G26(IO_L20N_M5DQ1_5)* H5(IO_L75N_M4BA1_4)* H6(IO_L75P_M4BA0_4)* H7(IO_L72N_M4ODT_4)* H8(IO_L82P_M4A13_4)* H18(IO_L9P_M5BA0_5)* H19(IO_L27P_5)* J3(IO_L69N_M4LDM_4)* J4(IO_L69P_M4UDM_4)* J5(IO_L71N_M4A6_4)* J7(IO_L72P_M4A3_4)* J10(IO_L76P_M4A7_4)* J20(IO_L27N_5)* J22(IO_L14N_M5CASN_5)* J23(IO_L15P_M5UDM_5)* J24(IO_L15N_M5LDM_5)* J25(IO_L22P_M5DQ10_5)* J26(IO_L22N_M5DQ11_5)* K5(IO_L71P_M4A5_4)* K6(IO_L70N_M4CASN_4)* K7(IO_L70P_M4RASN_4)* K9(IO_L76N_M4A2_4)* K10(IO_L74P_M4A0_4)* K20(IO_L13P_M5A5_5)* K21(IO_L13N_M5A6_5)* K22(IO_L14P_M5RASN_5)* K24(IO_L21P_M5DQ8_5)* K26(IO_L21N_M5DQ9_5)* L9(IO_L74N_M4A1_4)* L20(IO_L26P_5)* L21(IO_L26N_VREF_5)* L25(IO_L24P_M5DQ12_5)* L26(IO_L24N_M5DQ13_5)* M24(IO_L23P_M5UDQS_5)* M26(IO_L23N_M5UDQSN_5)* N25(IO_L25P_M5DQ14_5)* N26(IO_L25N_M5DQ15_5)*

### Notes on the sheet
- Les entrées/sorties LVDS des ADC et DAC sont branché à la banque 1 (3.3V). Tous les IO single ended sont branché ici à la banque 5 (1V8).
- 0.05A @ 3V3D
- 0.05A @ 1V8D
- Sheet Name
- Project Title
- Global Project
- Size
- Group
- Revision
- Date
- Sheet
- of
- Filename
- Designers
- (in symbol FPGA_XC6SLX100-3FGG676C, part E) BANK 4
- (in symbol FPGA_XC6SLX100-3FGG676C, part F) BANK 5

### Library data of the parts
C69 C73 = CAP - 1210: Precision: 10%; Current: *; CreatedBy: Jonathan Bouchard; Power: *
C70 C74 = CAP - 0805: Precision: 10%; Current: *; CreatedBy: Jonathan Bouchard; Power: *
C71 C72 C75 C76 = CAP - 0402: Precision: 10%; Current: *; CreatedBy: Jonathan Bouchard; Power: *
U13 = FPGA_XC6SLX100-3FGG676C: FPGA - XILINX SPARTAN 6 480 I/O - BGA-676; Voltage: 1.14 V ~ 1.26 V; Current: *; Power: *; Mfg: Xilinx; Mfg Part Number: XC6SLX100-3FGG676C; HelpURL: https://www.xilinx.com/support/documentation/data_sheets/ds162.pdf; CreatedBy: Jonathan Bouchard; Temperature: 0°C ~ 85°C (TJ); Value: *; Precision: *; Package: BGA-676; Supplier 1: Digikey; Supplier Part Number 1: 122-1760-ND

## Sheet S7CAS-PLEIADES-CARTE-MERE_P06_FPGA4.SCHDOC
size Tabloid; SheetNumber: 9; SheetTotal: 18; Sheet_Name: FPGA4; Size: 11x17
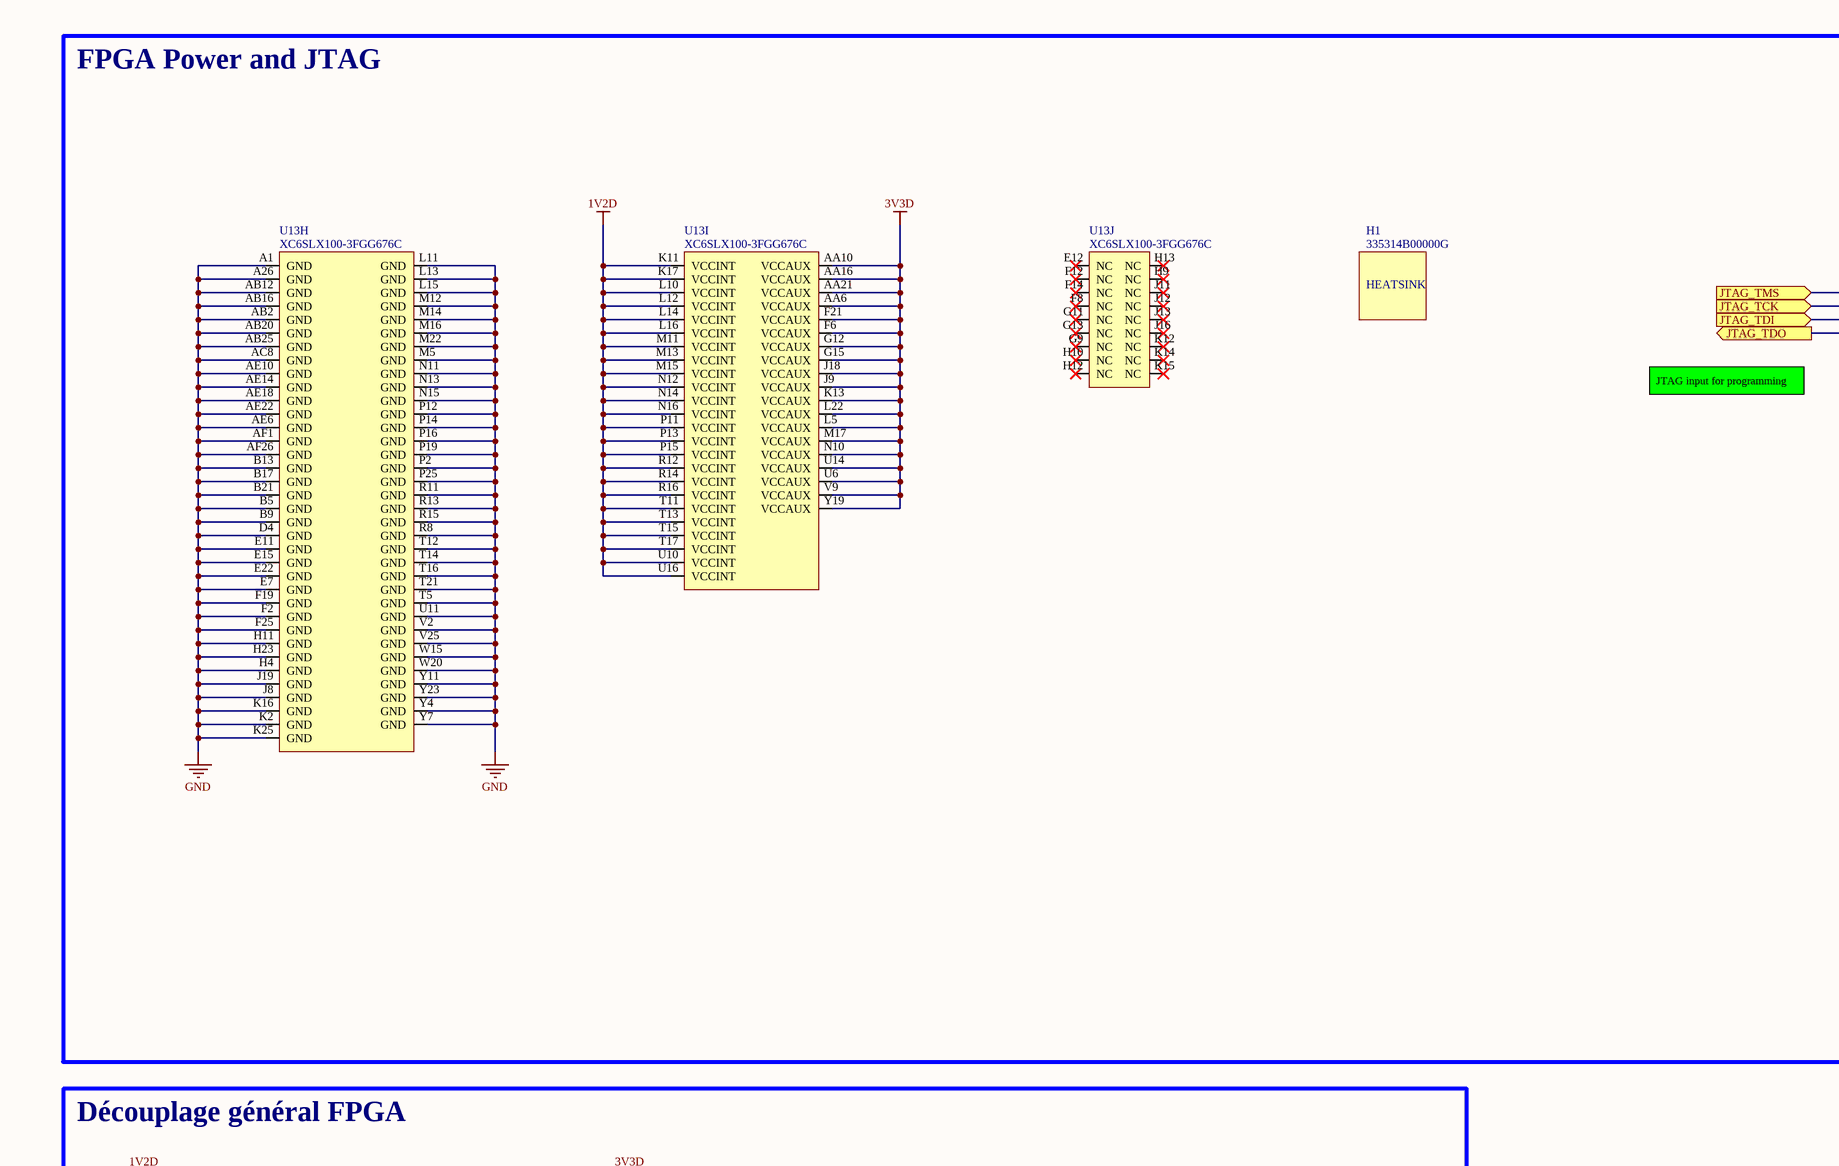
[diagram p19: S7CAS-PLEIADES-CARTE-MERE_P06_FPGA4.SCHDOC, top left]
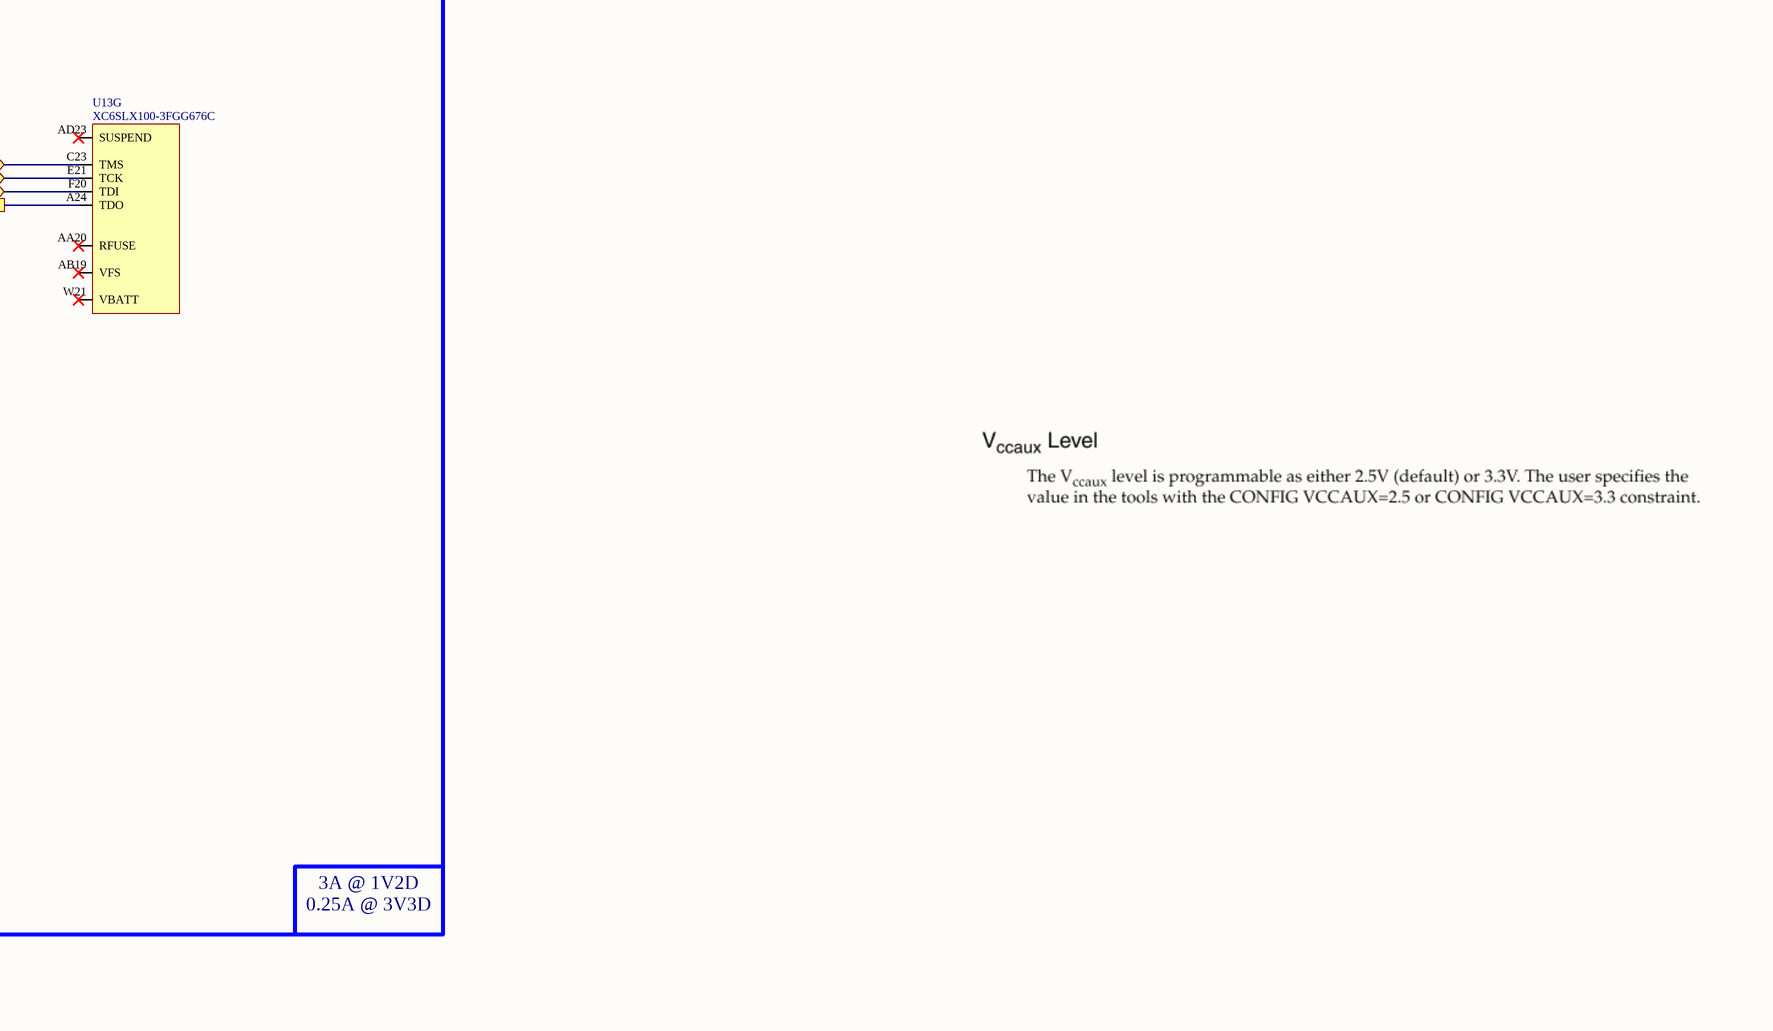
[diagram p20: S7CAS-PLEIADES-CARTE-MERE_P06_FPGA4.SCHDOC, top right]
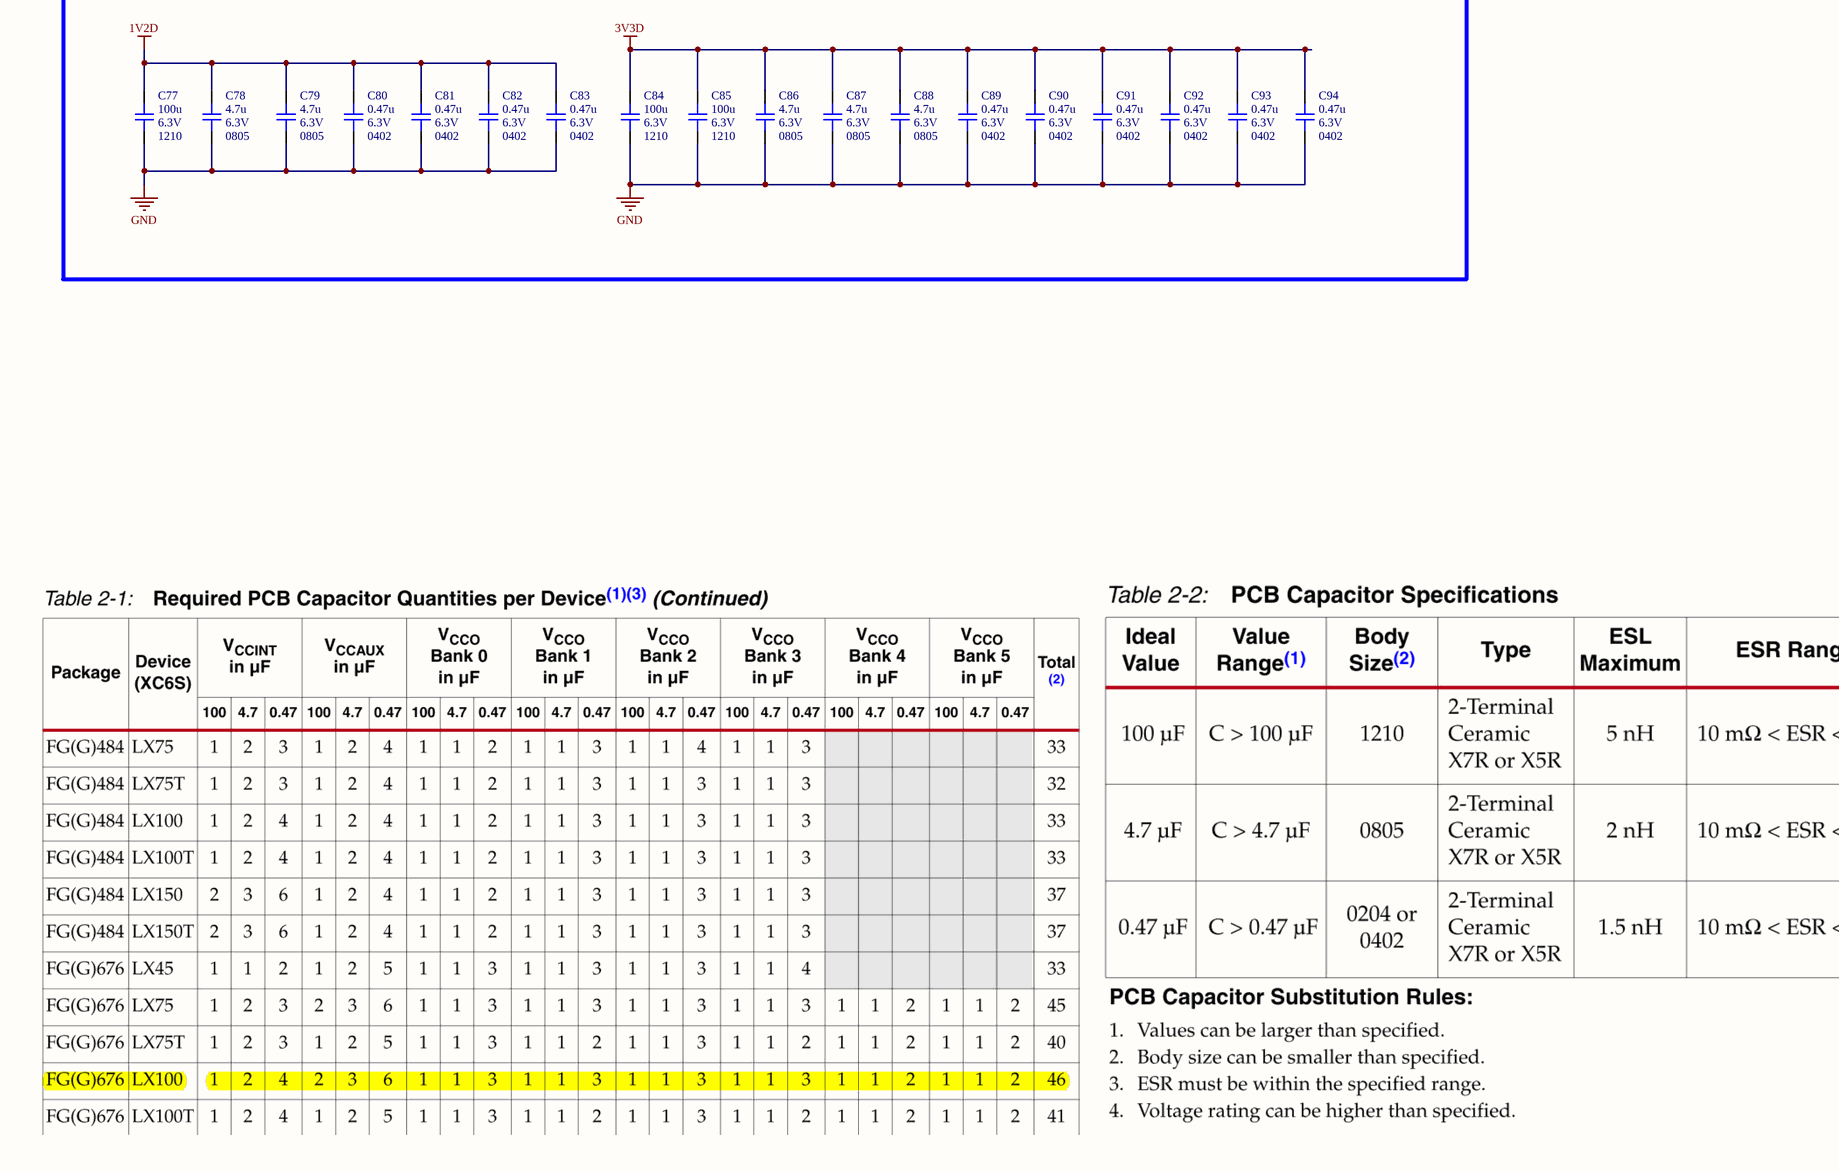
[diagram p21: S7CAS-PLEIADES-CARTE-MERE_P06_FPGA4.SCHDOC, bottom left]
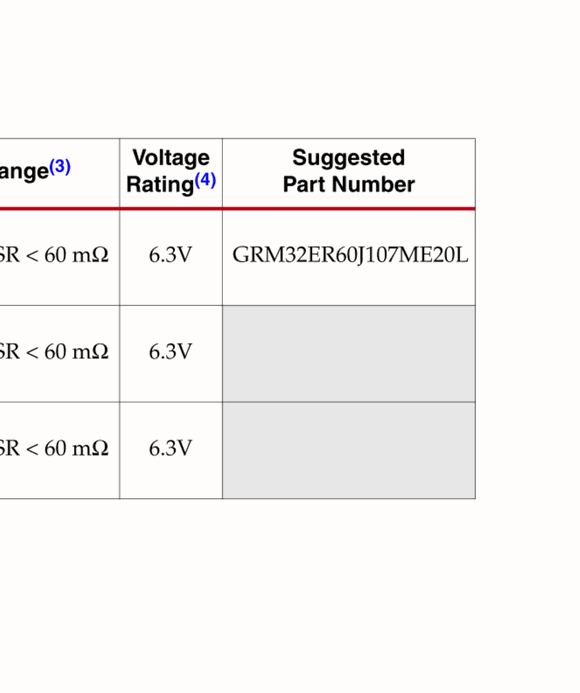
[diagram p22: S7CAS-PLEIADES-CARTE-MERE_P06_FPGA4.SCHDOC, bottom right]

### Parts
C77  value 100u  Voltage: 6.3V  Package: 1210  [CAP_1210]  (hidden comment: CAP - 1210)
C78  value 4.7u  Voltage: 6.3V  Package: 0805  [CAP_0805]  (hidden comment: CAP - 0805)
C79  value 4.7u  Voltage: 6.3V  Package: 0805  [CAP_0805]  (hidden comment: CAP - 0805)
C80  value 0.47u  Voltage: 6.3V  Package: 0402  [CAP_0402]  (hidden comment: CAP - 0402)
C81  value 0.47u  Voltage: 6.3V  Package: 0402  [CAP_0402]  (hidden comment: CAP - 0402)
C82  value 0.47u  Voltage: 6.3V  Package: 0402  [CAP_0402]  (hidden comment: CAP - 0402)
C83  value 0.47u  Voltage: 6.3V  Package: 0402  [CAP_0402]  (hidden comment: CAP - 0402)
C84  value 100u  Voltage: 6.3V  Package: 1210  [CAP_1210]  (hidden comment: CAP - 1210)
C85  value 100u  Voltage: 6.3V  Package: 1210  [CAP_1210]  (hidden comment: CAP - 1210)
C86  value 4.7u  Voltage: 6.3V  Package: 0805  [CAP_0805]  (hidden comment: CAP - 0805)
C87  value 4.7u  Voltage: 6.3V  Package: 0805  [CAP_0805]  (hidden comment: CAP - 0805)
C88  value 4.7u  Voltage: 6.3V  Package: 0805  [CAP_0805]  (hidden comment: CAP - 0805)
C89  value 0.47u  Voltage: 6.3V  Package: 0402  [CAP_0402]  (hidden comment: CAP - 0402)
C90  value 0.47u  Voltage: 6.3V  Package: 0402  [CAP_0402]  (hidden comment: CAP - 0402)
C91  value 0.47u  Voltage: 6.3V  Package: 0402  [CAP_0402]  (hidden comment: CAP - 0402)
C92  value 0.47u  Voltage: 6.3V  Package: 0402  [CAP_0402]  (hidden comment: CAP - 0402)
C93  value 0.47u  Voltage: 6.3V  Package: 0402  [CAP_0402]  (hidden comment: CAP - 0402)
C94  value 0.47u  Voltage: 6.3V  Package: 0402  [CAP_0402]  (hidden comment: CAP - 0402)
H1  335314B00000G
U13  XC6SLX100-3FGG676C  [FPGA_XILINX_FGG676]  (parts G,H,I,J of 10)

### Blocks framed on the sheet
FPGA Power and JTAG: H1 U13
Découplage général FPGA: C77-C94

### Ports
JTAG_TCK (in, see S7CAS-PLEIADES-CARTE-MERE_P06_USB_PROGRAMER[6B]), JTAG_TDI (in, see S7CAS-PLEIADES-CARTE-MERE_P06_USB_PROGRAMER[6B]), JTAG_TDO (out, see S7CAS-PLEIADES-CARTE-MERE_P06_USB_PROGRAMER[6B]), JTAG_TMS (in, see S7CAS-PLEIADES-CARTE-MERE_P06_USB_PROGRAMER[6B])

### Nets
1V2D: C77.2 C78.2 C79.2 C80.2 C81.2 C82.2 C83.2 U13.K11(VCCINT) U13.K17(VCCINT) U13.L10(VCCINT) U13.L12(VCCINT) U13.L14(VCCINT) U13.L16(VCCINT) U13.M11(VCCINT) U13.M13(VCCINT) U13.M15(VCCINT) U13.N12(VCCINT) U13.N14(VCCINT) U13.N16(VCCINT) U13.P11(VCCINT) U13.P13(VCCINT) U13.P15(VCCINT) U13.R12(VCCINT) U13.R14(VCCINT) U13.R16(VCCINT) U13.T11(VCCINT) U13.T13(VCCINT) U13.T15(VCCINT) U13.T17(VCCINT) U13.U10(VCCINT) U13.U16(VCCINT)
3V3D: C84.2 C85.2 C86.2 C87.2 C88.2 C89.2 C90.2 C91.2 C92.2 C93.2 C94.2 U13.AA6(VCCAUX) U13.AA10(VCCAUX) U13.AA16(VCCAUX) U13.AA21(VCCAUX) U13.F6(VCCAUX) U13.F21(VCCAUX) U13.G12(VCCAUX) U13.G15(VCCAUX) U13.J9(VCCAUX) U13.J18(VCCAUX) U13.K13(VCCAUX) U13.L5(VCCAUX) U13.L22(VCCAUX) U13.M17(VCCAUX) U13.N10(VCCAUX) U13.U6(VCCAUX) U13.U14(VCCAUX) U13.V9(VCCAUX) U13.Y19(VCCAUX)
GND: C77.1 C78.1 C79.1 C80.1 C81.1 C82.1 C83.1 C84.1 C85.1 C86.1 C87.1 C88.1 C89.1 C90.1 C91.1 C92.1 C93.1 C94.1 U13.A1(GND) U13.A26(GND) U13.AB2(GND) U13.AB12(GND) U13.AB16(GND) U13.AB20(GND) U13.AB25(GND) U13.AC8(GND) U13.AE6(GND) U13.AE10(GND) U13.AE14(GND) U13.AE18(GND) U13.AE22(GND) U13.AF1(GND) U13.AF26(GND) U13.B5(GND) U13.B9(GND) U13.B13(GND) U13.B17(GND) U13.B21(GND) U13.D4(GND) U13.E7(GND) U13.E11(GND) U13.E15(GND) U13.E22(GND) U13.F2(GND) U13.F19(GND) U13.F25(GND) U13.H4(GND) U13.H11(GND) U13.H23(GND) U13.J8(GND) U13.J19(GND) U13.K2(GND) U13.K16(GND) U13.K25(GND) U13.L11(GND) U13.L13(GND) U13.L15(GND) U13.M5(GND) U13.M12(GND) U13.M14(GND) U13.M16(GND) U13.M22(GND) U13.N11(GND) U13.N13(GND) U13.N15(GND) U13.P2(GND) U13.P12(GND) U13.P14(GND) U13.P16(GND) U13.P19(GND) U13.P25(GND) U13.R8(GND) U13.R11(GND) U13.R13(GND) U13.R15(GND) U13.T5(GND) U13.T12(GND) U13.T14(GND) U13.T16(GND) U13.T21(GND) U13.U11(GND) U13.V2(GND) U13.V25(GND) U13.W15(GND) U13.W20(GND) U13.Y4(GND) U13.Y7(GND) U13.Y11(GND) U13.Y23(GND)
JTAG_TCK: U13.E21(TCK) ; port JTAG_TCK
JTAG_TDI: U13.F20(TDI) ; port JTAG_TDI
JTAG_TDO: U13.A24(TDO) ; port JTAG_TDO
JTAG_TMS: U13.C23(TMS) ; port JTAG_TMS

Not connected (* = marked no-connect by the designer): U13 AA20(RFUSE)* AB19(VFS)* AD23(SUSPEND)* E12(NC)* F8(NC)* F12(NC)* F14(NC)* G9(NC)* G11(NC)* G13(NC)* H9(NC)* H10(NC)* H12(NC)* H13(NC)* J11(NC)* J12(NC)* J13(NC)* J16(NC)* K12(NC)* K14(NC)* K15(NC)* W21(VBATT)*

### Notes on the sheet
- JTAG input for programming
- 3A @ 1V2D
  0.25A @ 3V3D
- Sheet Name
- Project Title
- Global Project
- Size
- Group
- Revision
- Date
- Sheet
- of
- Filename
- Designers
- (in symbol HSK_335314B00000G) HEATSINK

### Library data of the parts
C77 C84 C85 = CAP - 1210: Precision: 10%; Current: *; CreatedBy: Jonathan Bouchard; Power: *
C78 C79 C86-C88 = CAP - 0805: Precision: 10%; Current: *; CreatedBy: Jonathan Bouchard; Power: *
C80-C83 C89-C94 = CAP - 0402: Precision: 10%; Current: *; CreatedBy: Jonathan Bouchard; Power: *
H1 = HSK_335314B00000G: HSK - Heat sink 335314B00000G 27x27mm; GRAMS Lib Spec: 2.7
U13 = FPGA_XC6SLX100-3FGG676C: as U13 on sheet S7CAS-PLEIADES-CARTE-MERE_P06_FPGA3; Current: *; Power: *; Mfg: Xilinx; Mfg Part Number: XC6SLX100-3FGG676C; HelpURL: https://www.xilinx.com/support/documentation/data_sheets/ds162.pdf; CreatedBy: Jonathan Bouchard; Temperature: 0°C ~ 85°C (TJ); Value: *; Precision: *; Package: BGA-676; Supplier 1: Digikey; Supplier Part Number 1: 122-1760-ND

## Sheet S7CAS-PLEIADES-CARTE-MERE_P06_CLOCK.SchDoc
size Tabloid; SheetNumber: 10; SheetTotal: 18; Sheet_Name: CLOCK; Size: 11x17
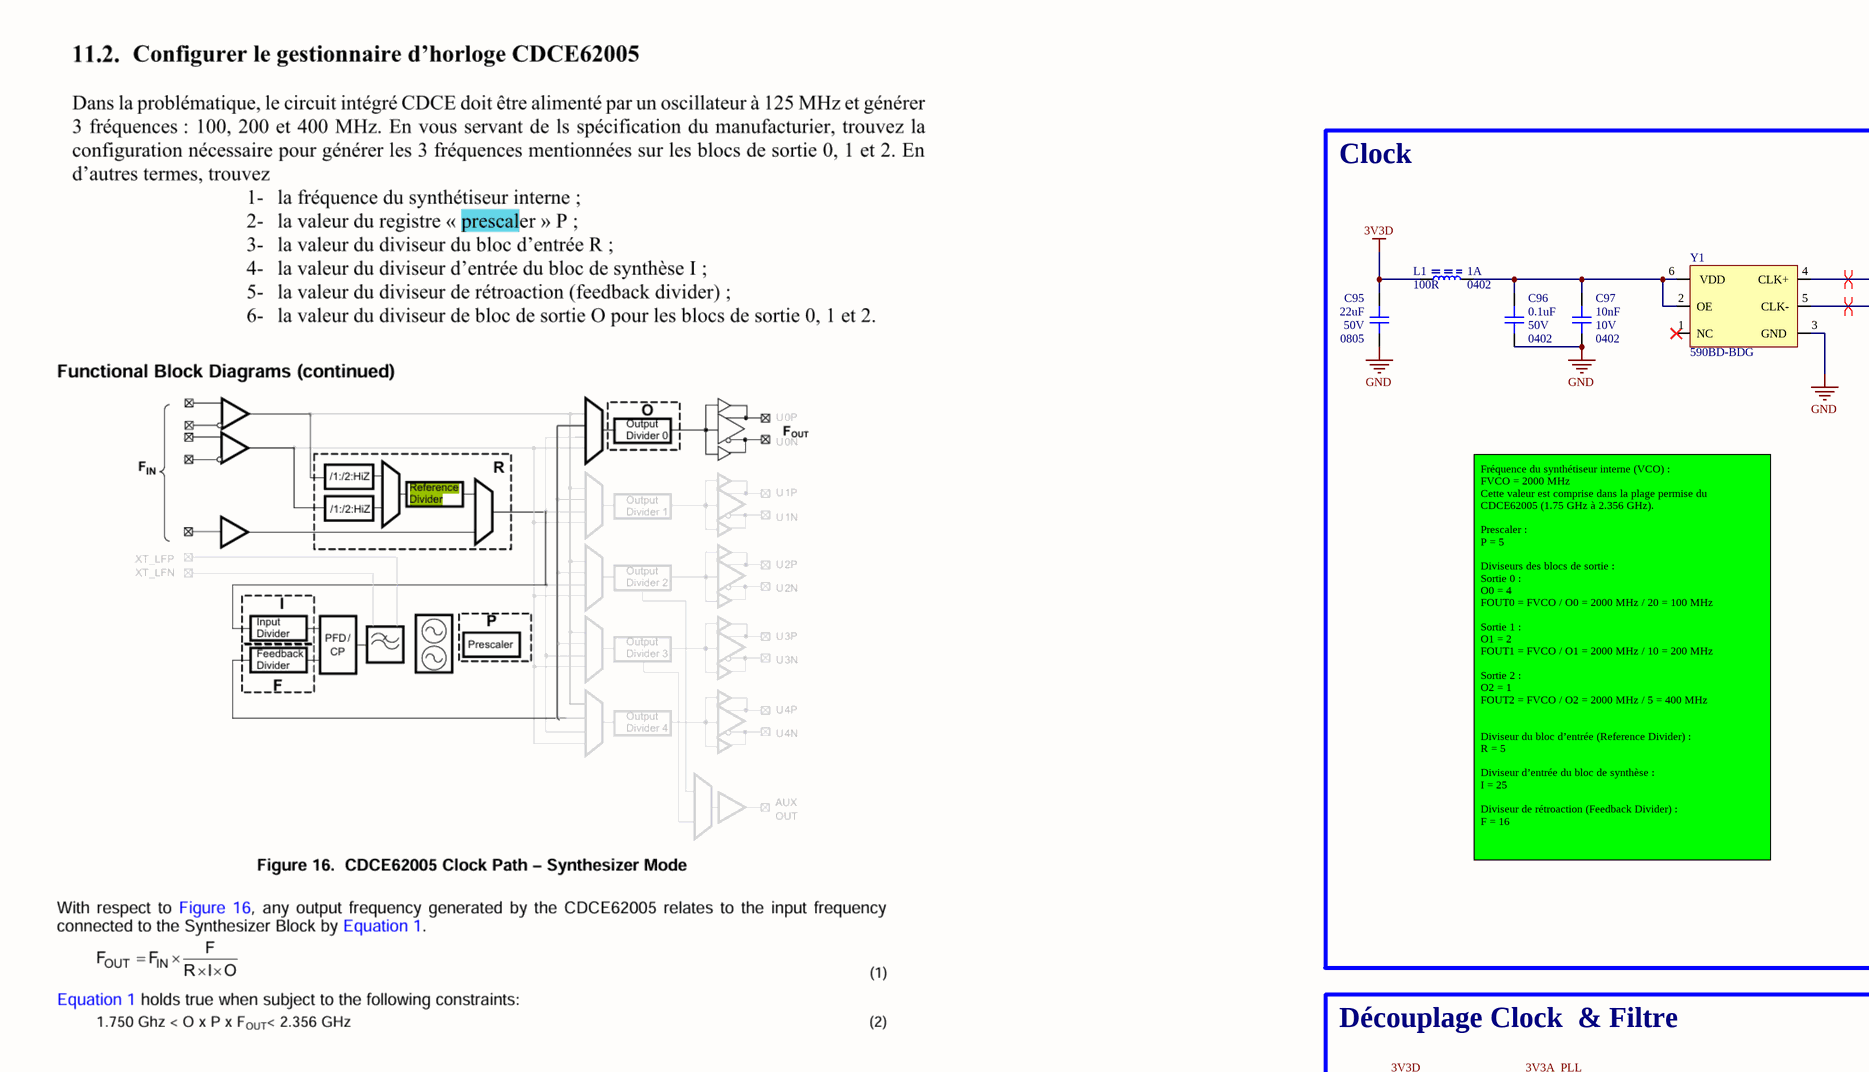
[diagram p23: S7CAS-PLEIADES-CARTE-MERE_P06_CLOCK.SchDoc, top left]
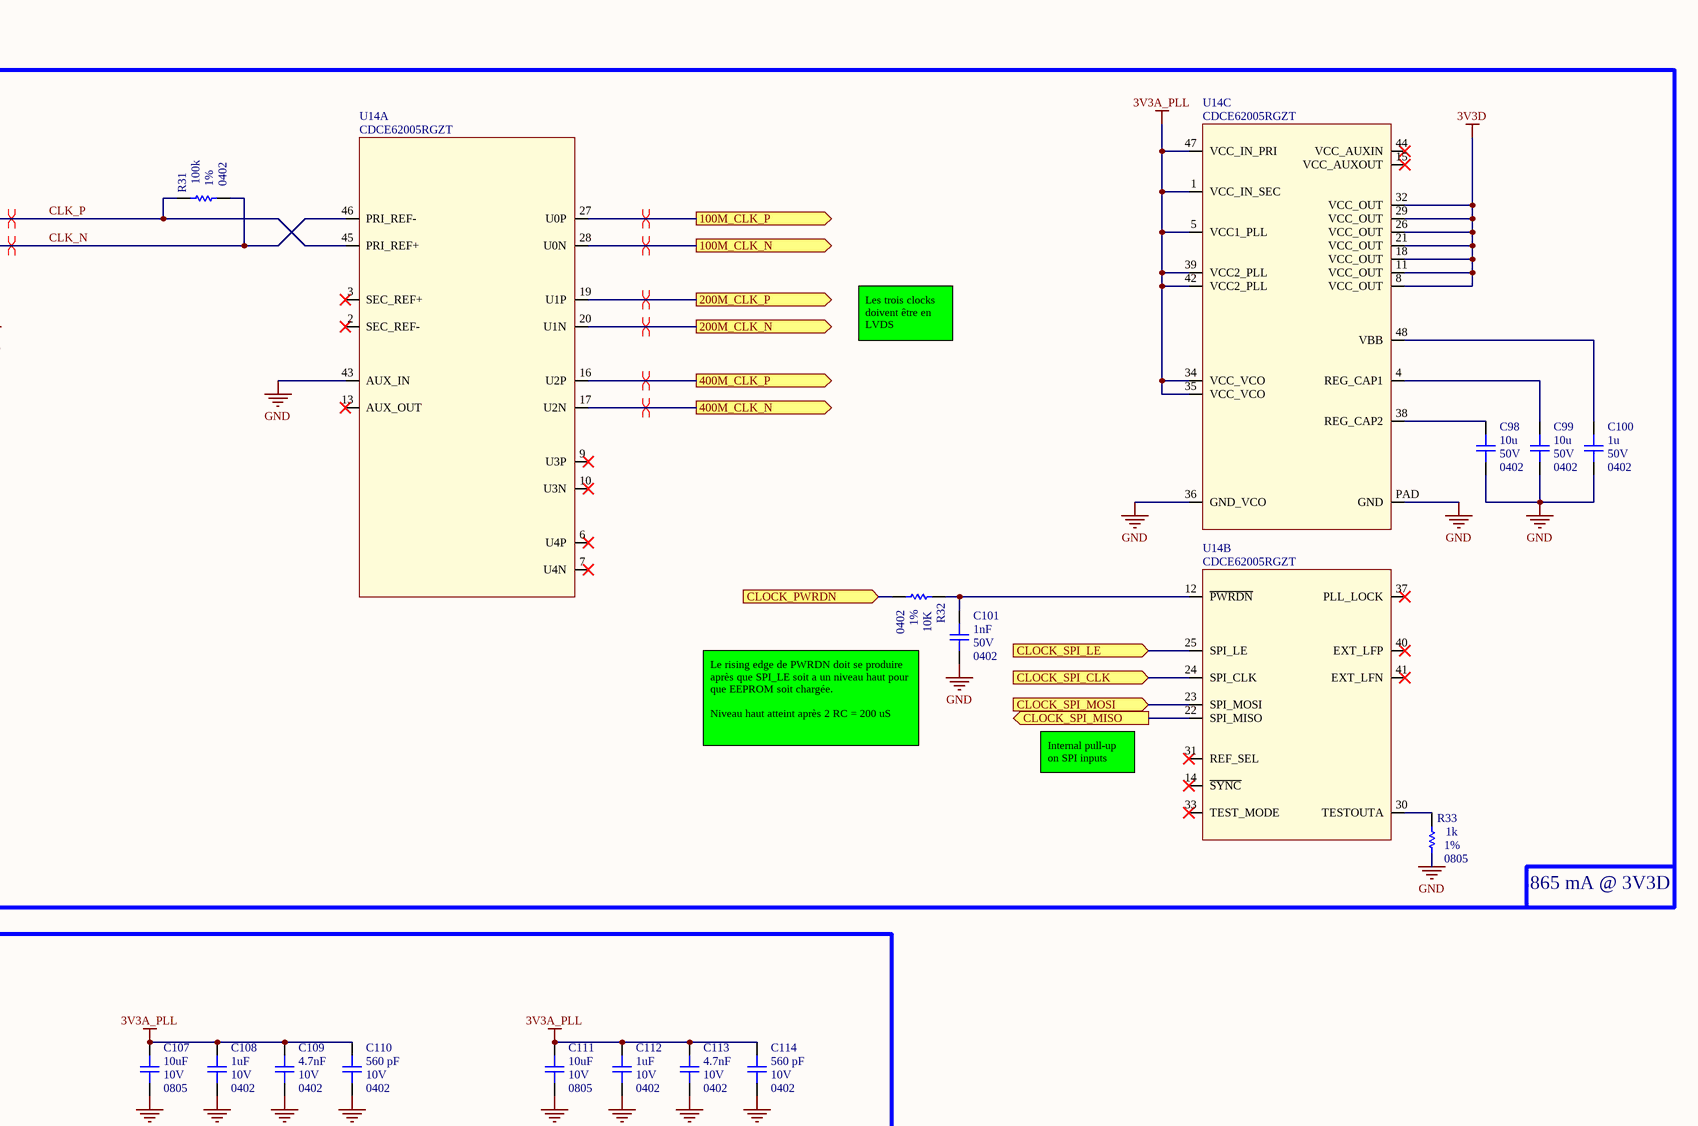
[diagram p24: S7CAS-PLEIADES-CARTE-MERE_P06_CLOCK.SchDoc, top middle]
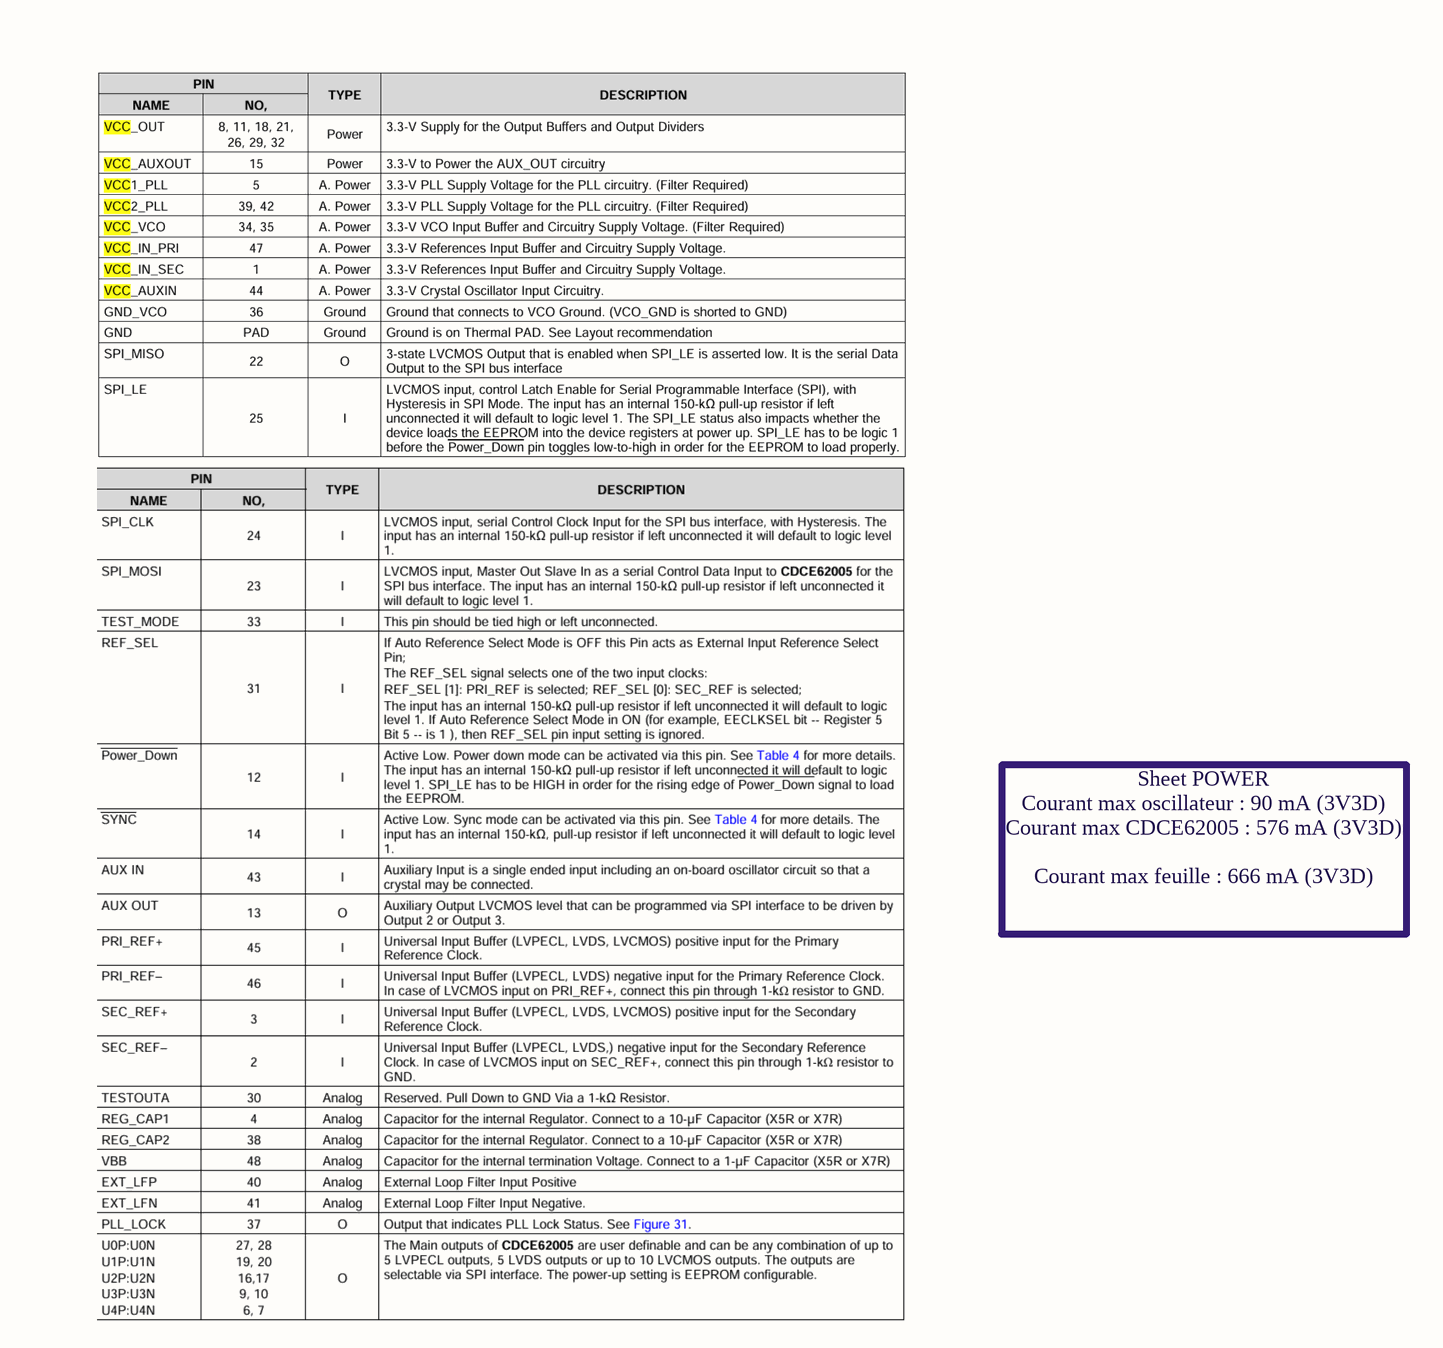
[diagram p25: S7CAS-PLEIADES-CARTE-MERE_P06_CLOCK.SchDoc, top right]
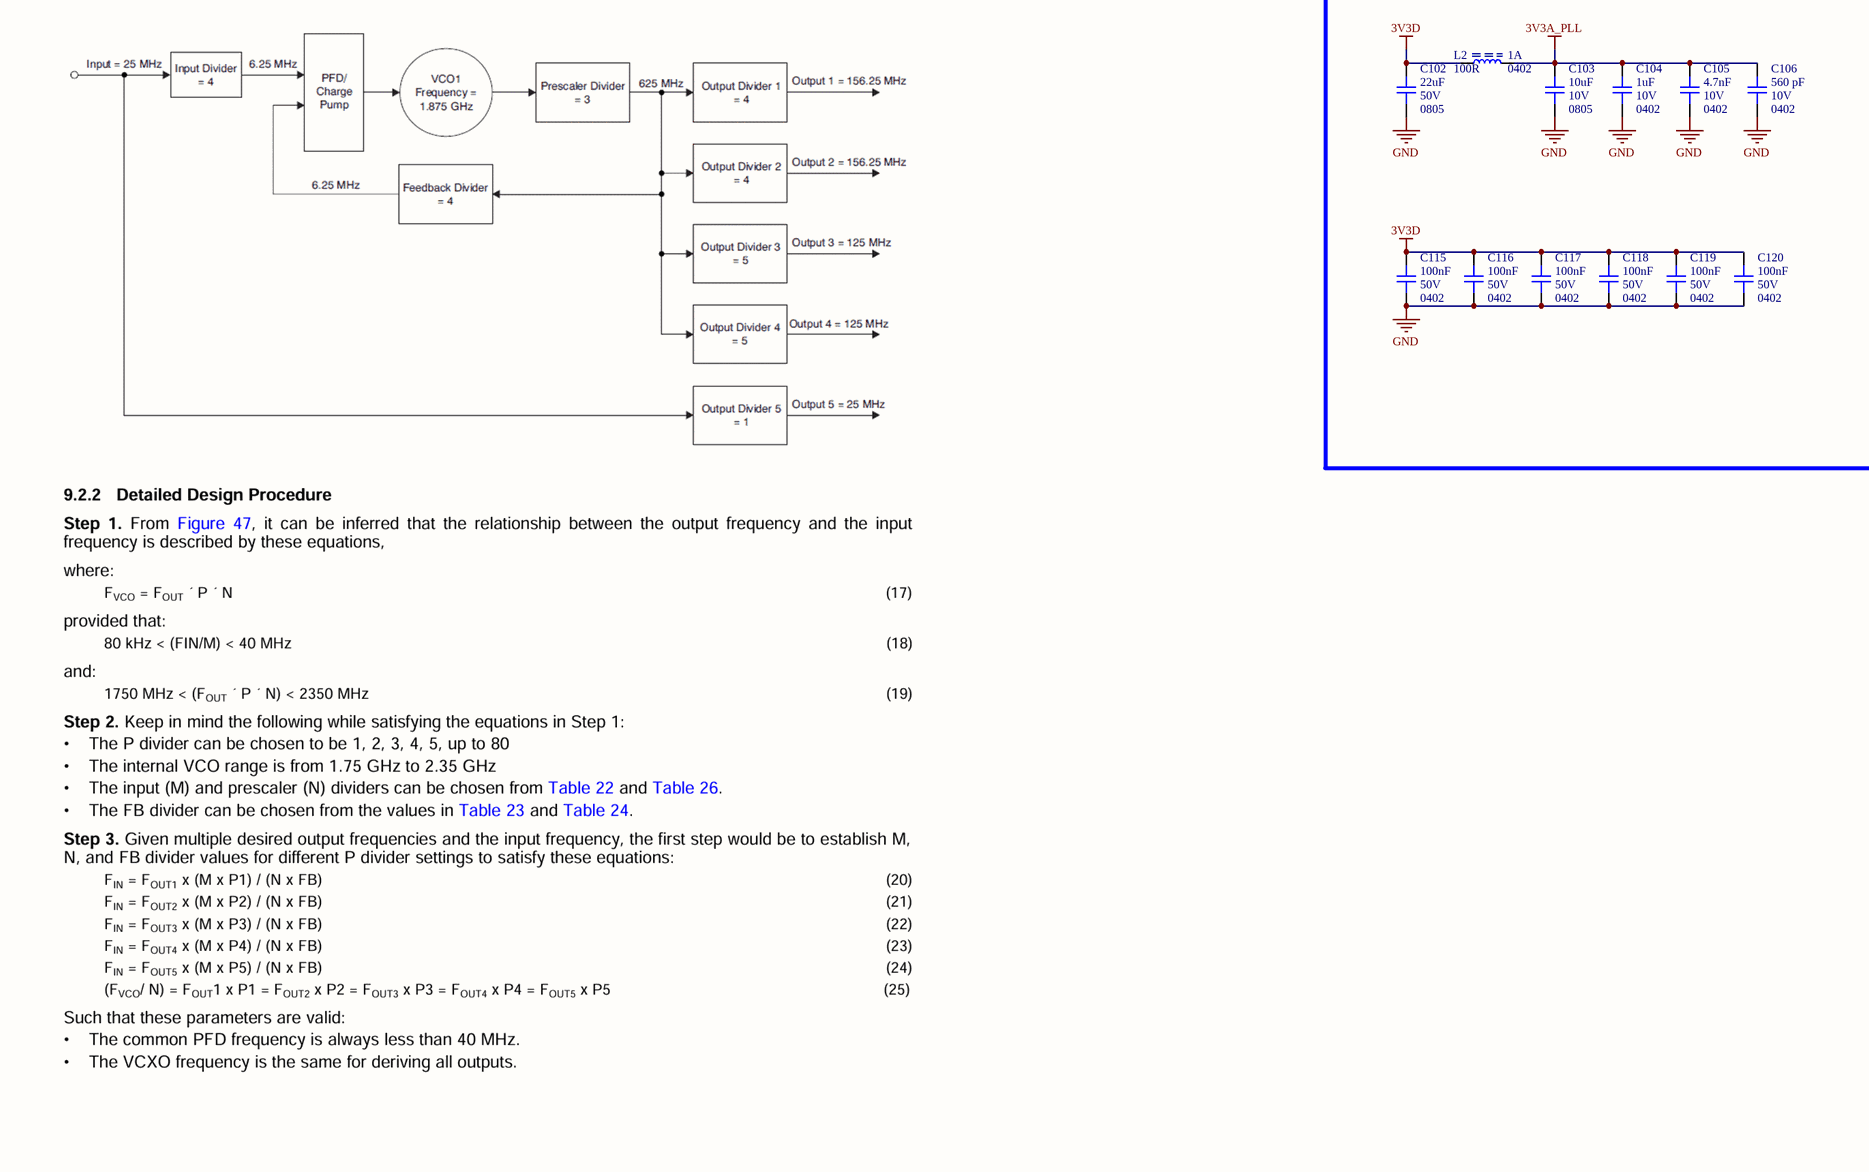
[diagram p26: S7CAS-PLEIADES-CARTE-MERE_P06_CLOCK.SchDoc, bottom left]
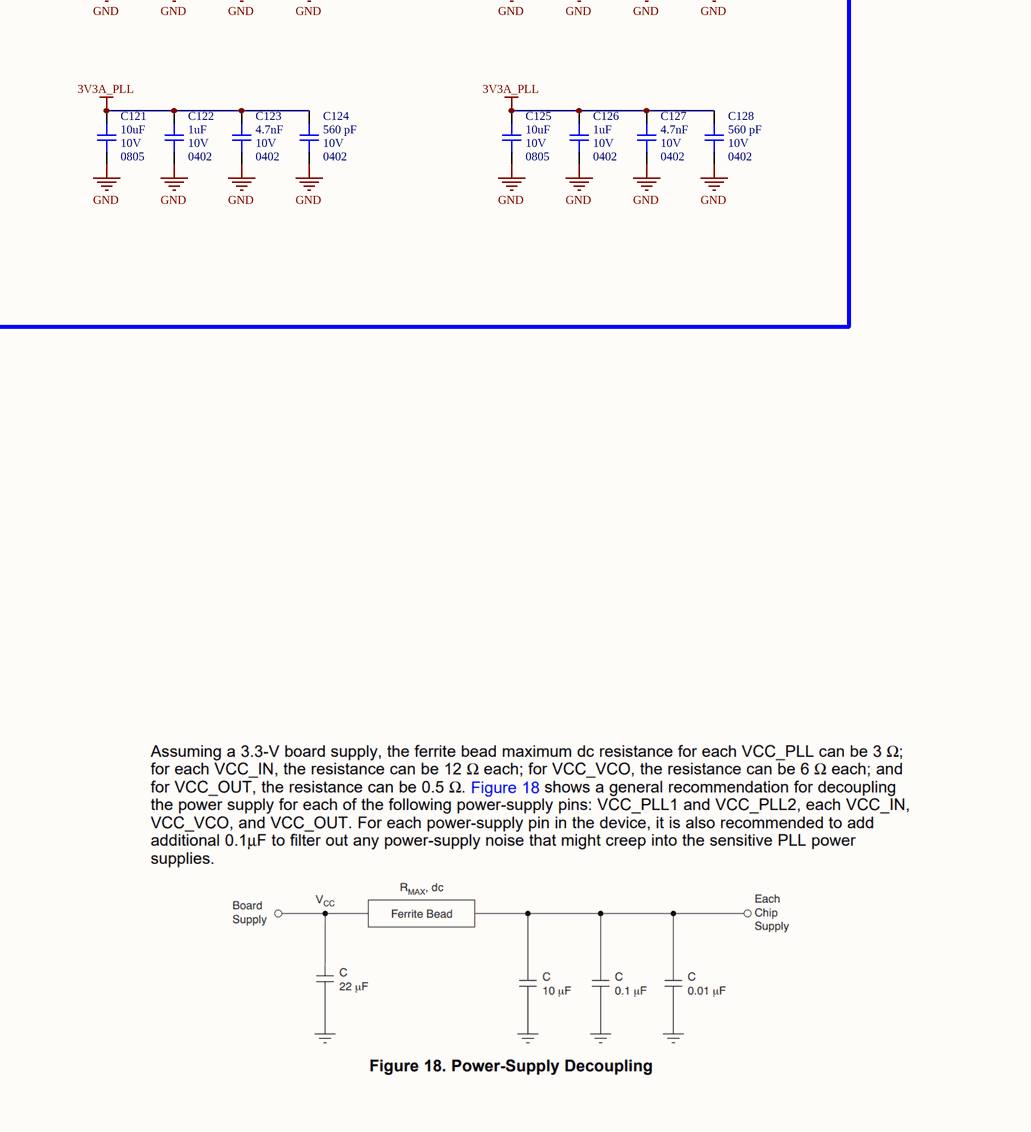
[diagram p27: S7CAS-PLEIADES-CARTE-MERE_P06_CLOCK.SchDoc, bottom middle]

### Parts
C95  value 22uF  Voltage: 50V  Package: 0805  [CAP_0805]  (hidden comment: CAP - 0805)
C96  value 0.1uF  Voltage: 50V  Package: 0402  [CAP_0402]  (hidden comment: CAP - 0402)
C97  value 10nF  Voltage: 10V  Package: 0402  [CAP_0402]  (hidden comment: CAP - 0402)
C98  value 10u  Voltage: 50V  Package: 0402  [CAP_0402]  (hidden comment: CAP - 0402)
C99  value 10u  Voltage: 50V  Package: 0402  [CAP_0402]  (hidden comment: CAP - 0402)
C100  value 1u  Voltage: 50V  Package: 0402  [CAP_0402]  (hidden comment: CAP - 0402)
C101  value 1nF  Voltage: 50V  Package: 0402  [CAP_0402]  (hidden comment: CAP - 0402)
C102  value 22uF  Voltage: 50V  Package: 0805  [CAP_0805]  (hidden comment: CAP - 0805)
C103  value 10uF  Voltage: 10V  Package: 0805  [CAP_0805]  (hidden comment: CAP - 0805)
C104  value 1uF  Voltage: 10V  Package: 0402  [CAP_0402]  (hidden comment: CAP - 0402)
C105  value 4.7nF  Voltage: 10V  Package: 0402  [CAP_0402]  (hidden comment: CAP - 0402)
C106  value 560 pF  Voltage: 10V  Package: 0402  [CAP_0402]  (hidden comment: CAP - 0402)
C107  value 10uF  Voltage: 10V  Package: 0805  [CAP_0805]  (hidden comment: CAP - 0805)
C108  value 1uF  Voltage: 10V  Package: 0402  [CAP_0402]  (hidden comment: CAP - 0402)
C109  value 4.7nF  Voltage: 10V  Package: 0402  [CAP_0402]  (hidden comment: CAP - 0402)
C110  value 560 pF  Voltage: 10V  Package: 0402  [CAP_0402]  (hidden comment: CAP - 0402)
C111  value 10uF  Voltage: 10V  Package: 0805  [CAP_0805]  (hidden comment: CAP - 0805)
C112  value 1uF  Voltage: 10V  Package: 0402  [CAP_0402]  (hidden comment: CAP - 0402)
C113  value 4.7nF  Voltage: 10V  Package: 0402  [CAP_0402]  (hidden comment: CAP - 0402)
C114  value 560 pF  Voltage: 10V  Package: 0402  [CAP_0402]  (hidden comment: CAP - 0402)
C115  value 100nF  Voltage: 50V  Package: 0402  [CAP_0402]  (hidden comment: CAP - 0402)
C116  value 100nF  Voltage: 50V  Package: 0402  [CAP_0402]  (hidden comment: CAP - 0402)
C117  value 100nF  Voltage: 50V  Package: 0402  [CAP_0402]  (hidden comment: CAP - 0402)
C118  value 100nF  Voltage: 50V  Package: 0402  [CAP_0402]  (hidden comment: CAP - 0402)
C119  value 100nF  Voltage: 50V  Package: 0402  [CAP_0402]  (hidden comment: CAP - 0402)
C120  value 100nF  Voltage: 50V  Package: 0402  [CAP_0402]  (hidden comment: CAP - 0402)
C121  value 10uF  Voltage: 10V  Package: 0805  [CAP_0805]  (hidden comment: CAP - 0805)
C122  value 1uF  Voltage: 10V  Package: 0402  [CAP_0402]  (hidden comment: CAP - 0402)
C123  value 4.7nF  Voltage: 10V  Package: 0402  [CAP_0402]  (hidden comment: CAP - 0402)
C124  value 560 pF  Voltage: 10V  Package: 0402  [CAP_0402]  (hidden comment: CAP - 0402)
C125  value 10uF  Voltage: 10V  Package: 0805  [CAP_0805]  (hidden comment: CAP - 0805)
C126  value 1uF  Voltage: 10V  Package: 0402  [CAP_0402]  (hidden comment: CAP - 0402)
C127  value 4.7nF  Voltage: 10V  Package: 0402  [CAP_0402]  (hidden comment: CAP - 0402)
C128  value 560 pF  Voltage: 10V  Package: 0402  [CAP_0402]  (hidden comment: CAP - 0402)
L1  value 100R  Current: 1A  Package: 0402  [FER_0402]  (hidden comment: FER - 0402)
L2  value 100R  Current: 1A  Package: 0402  [FER_0402]  (hidden comment: FER - 0402)
R31  value 100k  Package: 0402  Precision: 1%  [RES_0402]  (hidden comment: RES - 0402)
R32  value 10K  Package: 0402  Precision: 1%  [RES_0402]  (hidden comment: RES - 0402)
R33  value 1k  Package: 0805  Precision: 1%  [RES_0805]  (hidden comment: RES - 0805)
U14  CDCE62005RGZT  [TIM_CDCE62005RGZT]  (parts A,B,C of 3)
Y1  590BD-BDG  [OSC_590BD-BDG]

### Blocks framed on the sheet
Clock: C95-C101 L1 R31-R33 U14 Y1
Découplage Clock  & Filtre: C102-C128 L2

### Ports
100M_CLK_N (out, see S7CAS-PLEIADES-CARTE-MERE_P06_FPGA1[1C]), 100M_CLK_P (out, see S7CAS-PLEIADES-CARTE-MERE_P06_FPGA1[1C]), 200M_CLK_N (out, see S7CAS-PLEIADES-CARTE-MERE_P06_ADC[5A]), 200M_CLK_P (out, see S7CAS-PLEIADES-CARTE-MERE_P06_ADC[5A]), 400M_CLK_N (out, see S7CAS-PLEIADES-CARTE-MERE_P06_DAC[5B]), 400M_CLK_P (out, see S7CAS-PLEIADES-CARTE-MERE_P06_DAC[5B]), CLOCK_PWRDN (in, see S7CAS-PLEIADES-CARTE-MERE_P06_FPGA2[1A]), CLOCK_SPI_CLK (in, see S7CAS-PLEIADES-CARTE-MERE_P06_FPGA2[1B]), CLOCK_SPI_LE (in, see S7CAS-PLEIADES-CARTE-MERE_P06_FPGA2[1A]), CLOCK_SPI_MISO (out, see S7CAS-PLEIADES-CARTE-MERE_P06_FPGA2[1B]), CLOCK_SPI_MOSI (in, see S7CAS-PLEIADES-CARTE-MERE_P06_FPGA2[1B])

### Nets
3V3A_PLL: C103.2 C104.2 C105.2 C106.2 C107.2 C108.2 C109.2 C110.2 C111.2 C112.2 C113.2 C114.2 C121.2 C122.2 C123.2 C124.2 C125.2 C126.2 C127.2 C128.2 L2.1 U14.1(VCC_IN_SEC) U14.5(VCC1_PLL) U14.34(VCC_VCO) U14.35(VCC_VCO) U14.39(VCC2_PLL) U14.42(VCC2_PLL) U14.47(VCC_IN_PRI)
3V3D: C95.2 C102.2 C115.2 C116.2 C117.2 C118.2 C119.2 C120.2 L1.2 L2.2 U14.8(VCC_OUT) U14.11(VCC_OUT) U14.18(VCC_OUT) U14.21(VCC_OUT) U14.26(VCC_OUT) U14.29(VCC_OUT) U14.32(VCC_OUT)
GND: C95.1 C96.1 C97.1 C98.1 C99.1 C100.1 C101.1 C102.1 C103.1 C104.1 C105.1 C106.1 C107.1 C108.1 C109.1 C110.1 C111.1 C112.1 C113.1 C114.1 C115.1 C116.1 C117.1 C118.1 C119.1 C120.1 C121.1 C122.1 C123.1 C124.1 C125.1 C126.1 C127.1 C128.1 R33.1 U14.36(GND_VCO) U14.43(AUX_IN) U14.PAD(GND) Y1.3(GND)
100M_CLK_N: U14.28(U0N) ; port 100M_CLK_N
100M_CLK_P: U14.27(U0P) ; port 100M_CLK_P
200M_CLK_N: U14.20(U1N) ; port 200M_CLK_N
200M_CLK_P: U14.19(U1P) ; port 200M_CLK_P
400M_CLK_N: U14.17(U2N) ; port 400M_CLK_N
400M_CLK_P: U14.16(U2P) ; port 400M_CLK_P
CLK_N: R31.1 U14.46(PRI_REF-) Y1.5(CLK-)
CLK_P: R31.2 U14.45(PRI_REF+) Y1.4(CLK+)
CLOCK_PWRDN: R32.1 ; port CLOCK_PWRDN
CLOCK_SPI_CLK: U14.24(SPI_CLK) ; port CLOCK_SPI_CLK
CLOCK_SPI_LE: U14.25(SPI_LE) ; port CLOCK_SPI_LE
CLOCK_SPI_MISO: U14.22(SPI_MISO) ; port CLOCK_SPI_MISO
CLOCK_SPI_MOSI: U14.23(SPI_MOSI) ; port CLOCK_SPI_MOSI
NetC96_2: C96.2 C97.2 L1.1 Y1.2(OE) Y1.6(VDD)
NetC98_2: C98.2 U14.38(REG_CAP2)
NetC99_2: C99.2 U14.4(REG_CAP1)
NetC100_2: C100.2 U14.48(VBB)
NetC101_2: C101.2 R32.2 U14.12(~{PWRDN})
NetR33_2: R33.2 U14.30(TESTOUTA)

Not connected (* = marked no-connect by the designer): U14 2(SEC_REF-)* 3(SEC_REF+)* 6(U4P)* 7(U4N)* 9(U3P)* 10(U3N)* 13(AUX_OUT)* 14(~{SYNC})* 15(VCC_AUXOUT)* 31(REF_SEL)* 33(TEST_MODE)* 37(PLL_LOCK)* 40(EXT_LFP)* 41(EXT_LFN)* 44(VCC_AUXIN)*; Y1 1(NC)*

### Layout directives
differential pair: 100M_CLK_N, 100M_CLK_P, 200M_CLK_N, 200M_CLK_P, 400M_CLK_N, 400M_CLK_P, CLK_N, CLK_P

### Notes on the sheet
- Les trois clocks doivent être en LVDS
- Le rising edge de PWRDN doit se produire après que SPI_LE soit a un niveau haut pour que EEPROM soit chargée.
  Niveau haut atteint après 2 RC = 200 uS
- Internal pull-up on SPI inputs
- Fréquence du synthétiseur interne (VCO) :
  FVCO = 2000 MHz
  Cette valeur est comprise dans la plage permise du CDCE62005 (1.75 GHz à 2.356 GHz).
  Prescaler :
  P = 5
  Diviseurs des blocs de sortie :
  Sortie 0 :
  O0 = 4
  FOUT0 = FVCO / O0 = 2000 MHz / 20 = 100 MHz
  Sortie 1 :
  O1 = 2
  FOUT1 = FVCO / O1 = 2000 MHz / 10 = 200 MHz
  Sortie 2 :
  O2 = 1
  FOUT2 = FVCO / O2 = 2000 MHz / 5 = 400 MHz
  Diviseur du bloc d’entrée (Reference Divider) :
  R = 5
  Diviseur d’entrée du bloc de synthèse :
  I = 25
  Diviseur de rétroaction (Feedback Divider) :
  F = 16
- 865 mA @ 3V3D
- Sheet POWER
  Courant max oscillateur : 90 mA (3V3D)
  Courant max CDCE62005 : 576 mA (3V3D)
  Courant max feuille : 666 mA (3V3D)
- Sheet Name
- Project Title
- Global Project
- Size
- Group
- Revision
- Date
- Sheet
- of
- Filename
- Designers

### Library data of the parts
C95 C102 C103 C107 C111 C121 C125 = CAP - 0805: Precision: 10%; Current: *; CreatedBy: Jonathan Bouchard; Power: *
C96-C101 C104-C106 C108-C110 C112-C120 C122-C124 C126-C128 = CAP - 0402: Precision: 10%; Current: *; CreatedBy: Jonathan Bouchard; Power: *
R31 R32 = RES - 0402: Voltage: 50V; Power: 1/16W; Current: *; CreatedBy: Jonathan Bouchard
U14 = TIM_CDCE62005RGZT: TIM - CLK SYNTH JITTER CLEANER 3:5 - QFN-48; Voltage: 3 V ~ 3.6 V; Mfg: Texas Instruments; Current: *; Power: *; Mfg Part Number: CDCE62005RGZT; HelpURL: http://www.ti.com/lit/ds/symlink/cdce62005.pdf; CreatedBy: Jonathan Bouchard; Temperature: -40°C ~ 85°C; Value: *; Precision: *; Package: QFN-48; Supplier 1: Digikey; Supplier Part Number 1: 296-23947-1-ND
Y1 = OSC_590BD-BDG: TIM - OSC PROG 125MHz ~ 214.999MHz LVDS 3.3V 7PPM EN/DS - 6-SMD; Manufacturer #1: Silicon Labs; Current Rating: 100 mA (supply); Note: Spécifié la fréquence lors de la commande; Voltage rating: 3.3V (supply); Polarized: Yes; Value: ±7ppm (freq Stability), ±20ppm (freq stability total); Magnetic Material: UNKNOWN; GRAMS Lib Spec: 2.8; Manufacturer #2: *; Power Max: *; Part Number #1: 590BD-BDG; Part Number #2: *; HelpURL: https://www.silabs.com/documents/public/data-sheets/Si590-591.pdf; Supplier 1: Digi-Key; Supplier Part Number 1: 590BD-BDG-ND; Assembly Type: SMD; Temperature: -40°C ~ 85°C; Package: 6-SMD; CreatedBy/Date: from 590BD-CDG; Tolerance: *; VerifiedBy: Caroline Paulin / 3/10/2019; Cryo: UNKNOWN
L1 L2 = FER - 0402: Voltage: *; CreatedBy: Jonathan Bouchard; Power: *; Precision: *
R33 = RES - 0805: Current: *; CreatedBy: Jonathan Bouchard

## Sheet S7CAS-PLEIADES-CARTE-MERE_P06_ETHERNET.SCHDOC
size Tabloid; SheetNumber: 11; SheetTotal: 18; Sheet_Name: ETHERNET; Size: 11x17
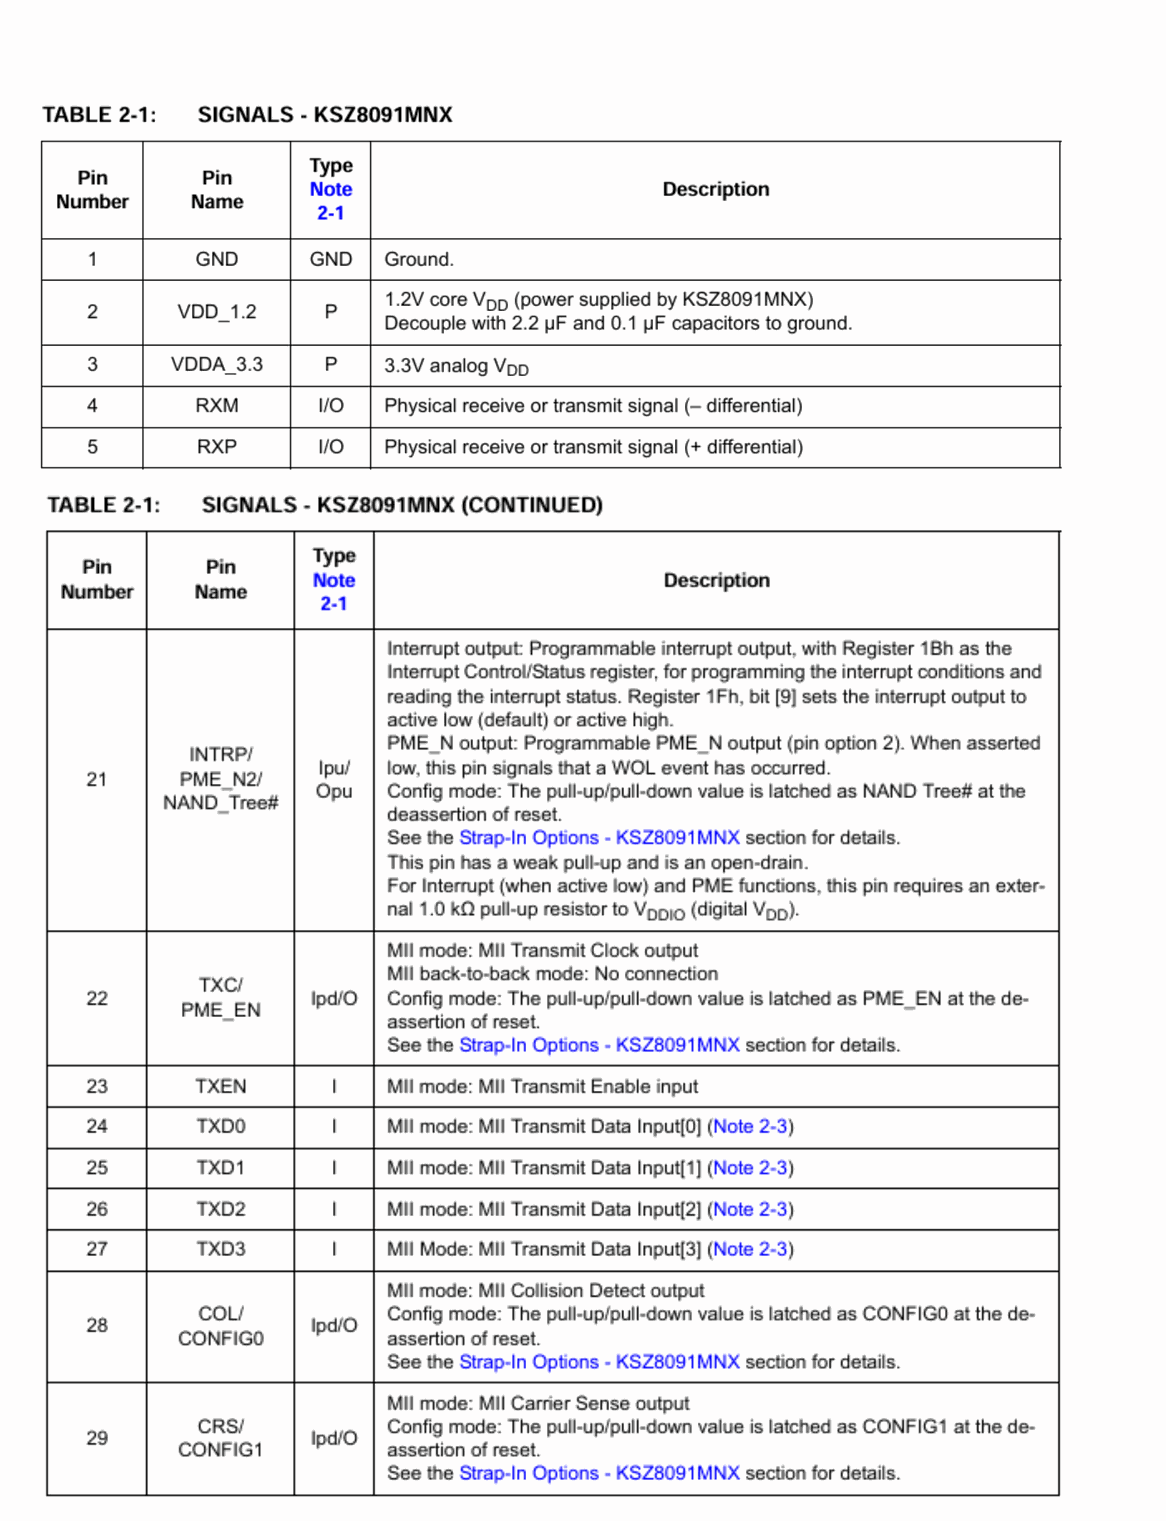
[diagram p28: S7CAS-PLEIADES-CARTE-MERE_P06_ETHERNET.SCHDOC, top left]
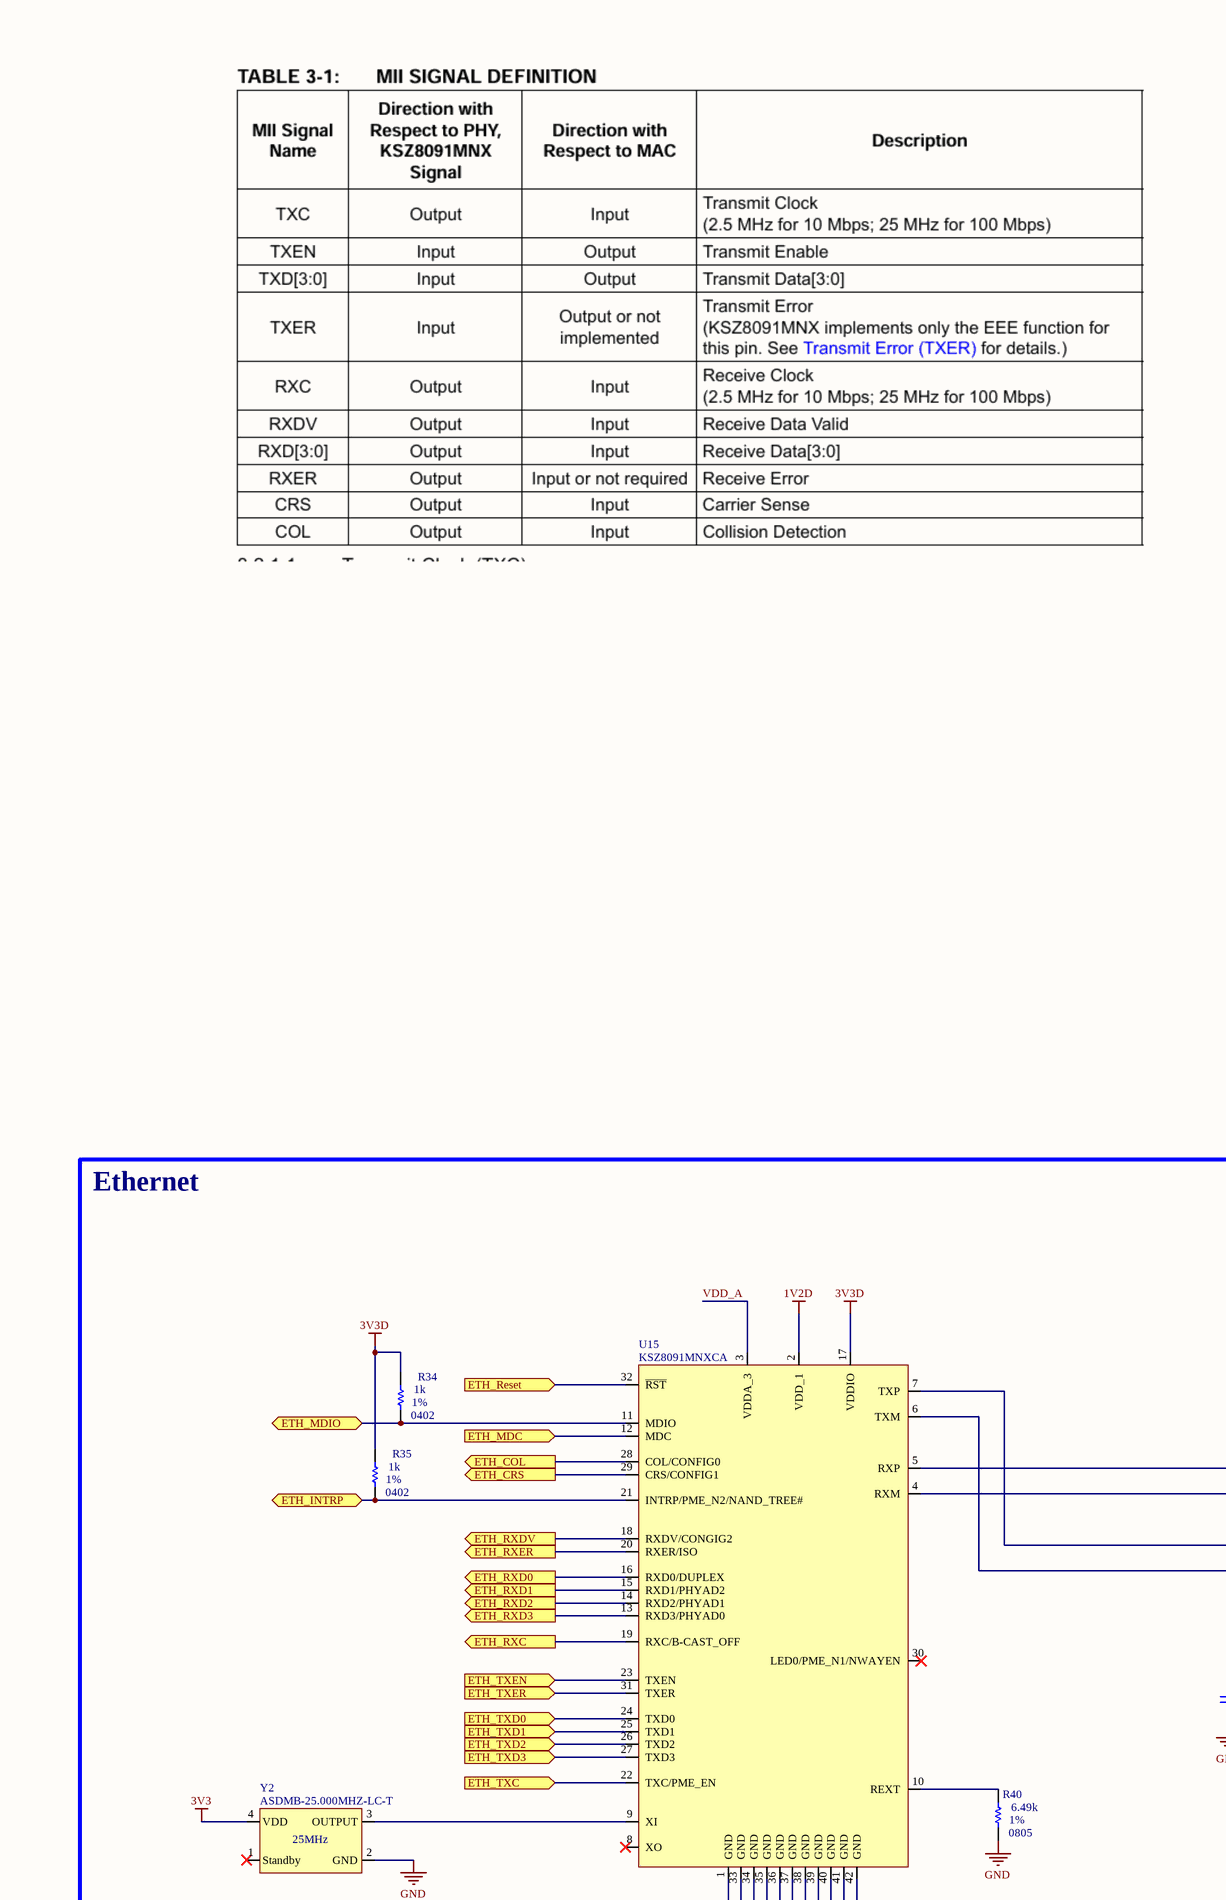
[diagram p29: S7CAS-PLEIADES-CARTE-MERE_P06_ETHERNET.SCHDOC, top middle]
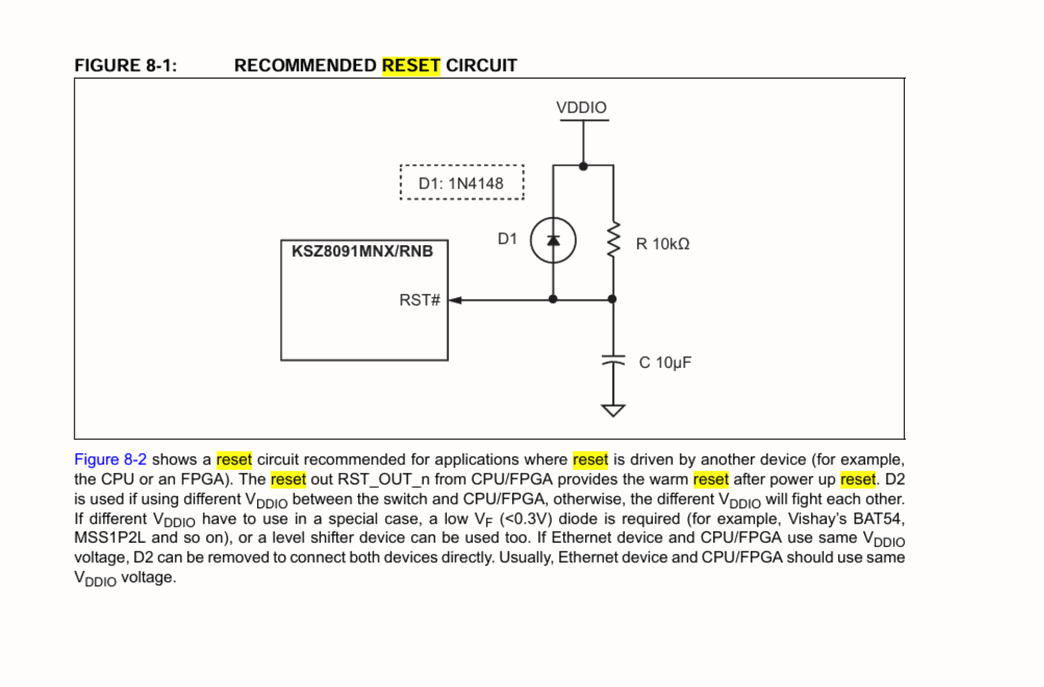
[diagram p30: S7CAS-PLEIADES-CARTE-MERE_P06_ETHERNET.SCHDOC, top right]
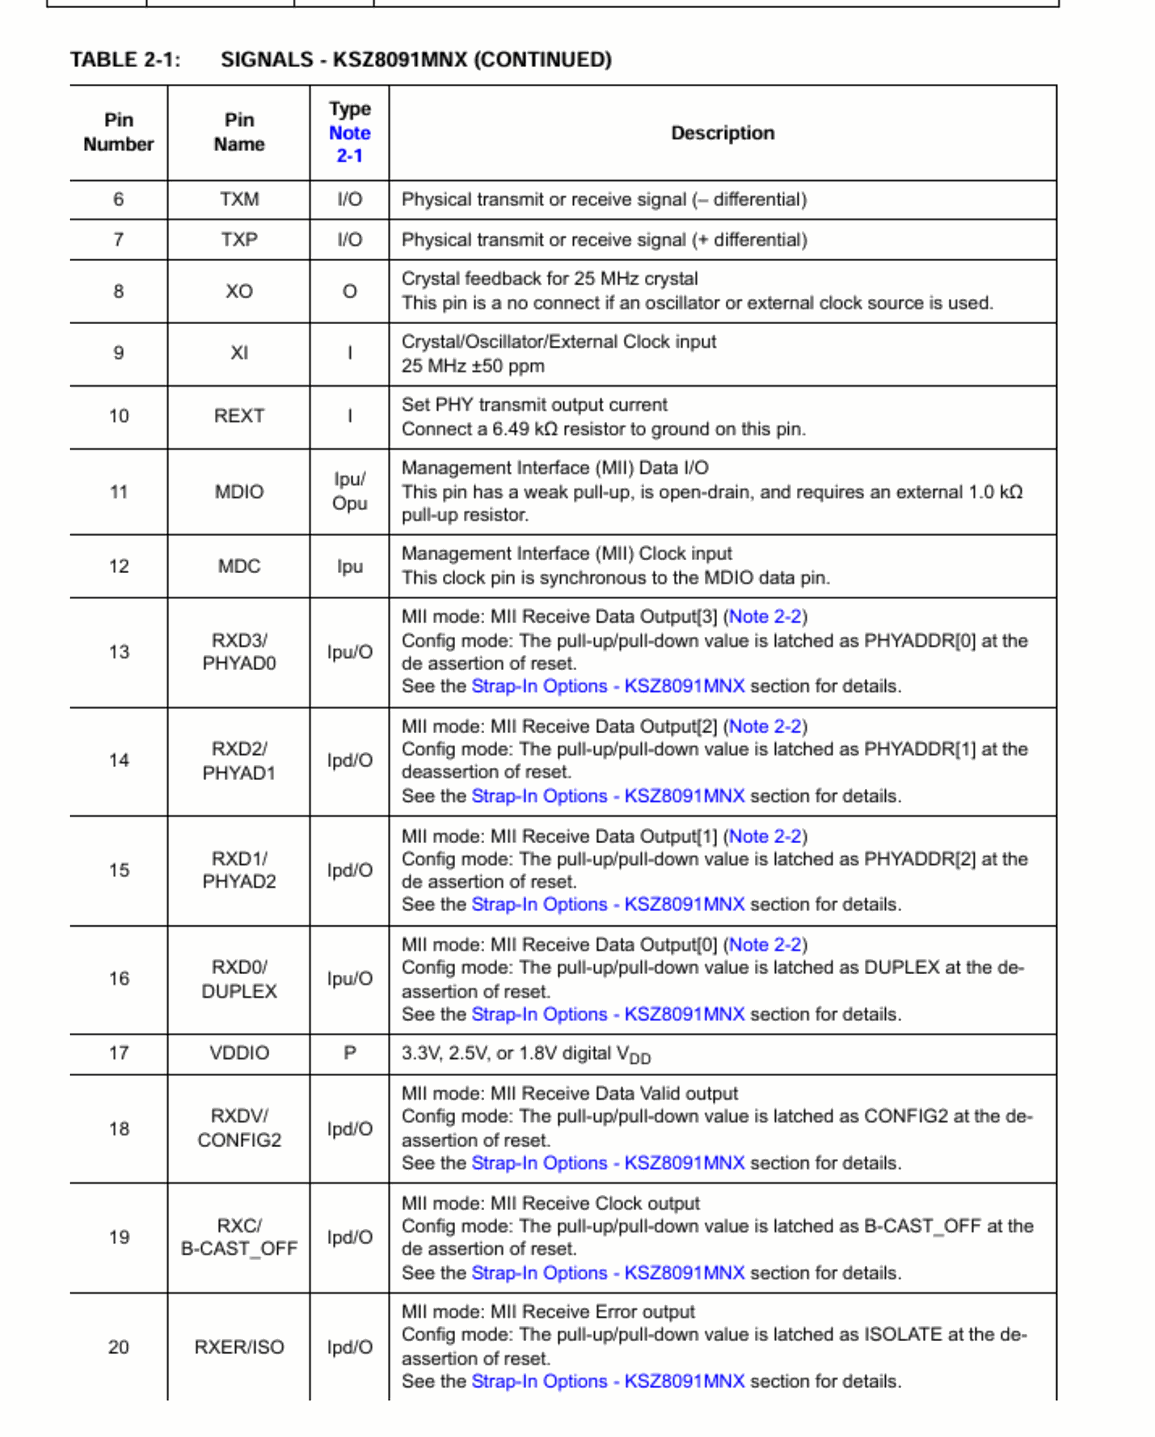
[diagram p31: S7CAS-PLEIADES-CARTE-MERE_P06_ETHERNET.SCHDOC, bottom left]
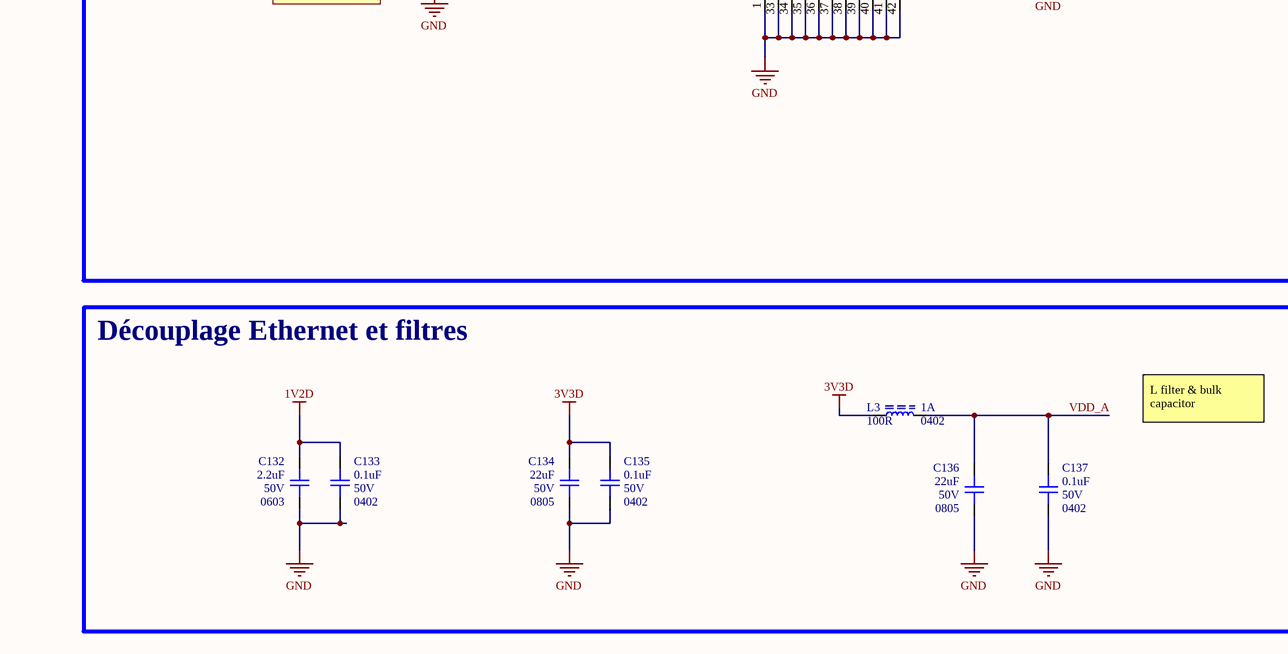
[diagram p32: S7CAS-PLEIADES-CARTE-MERE_P06_ETHERNET.SCHDOC, bottom middle]
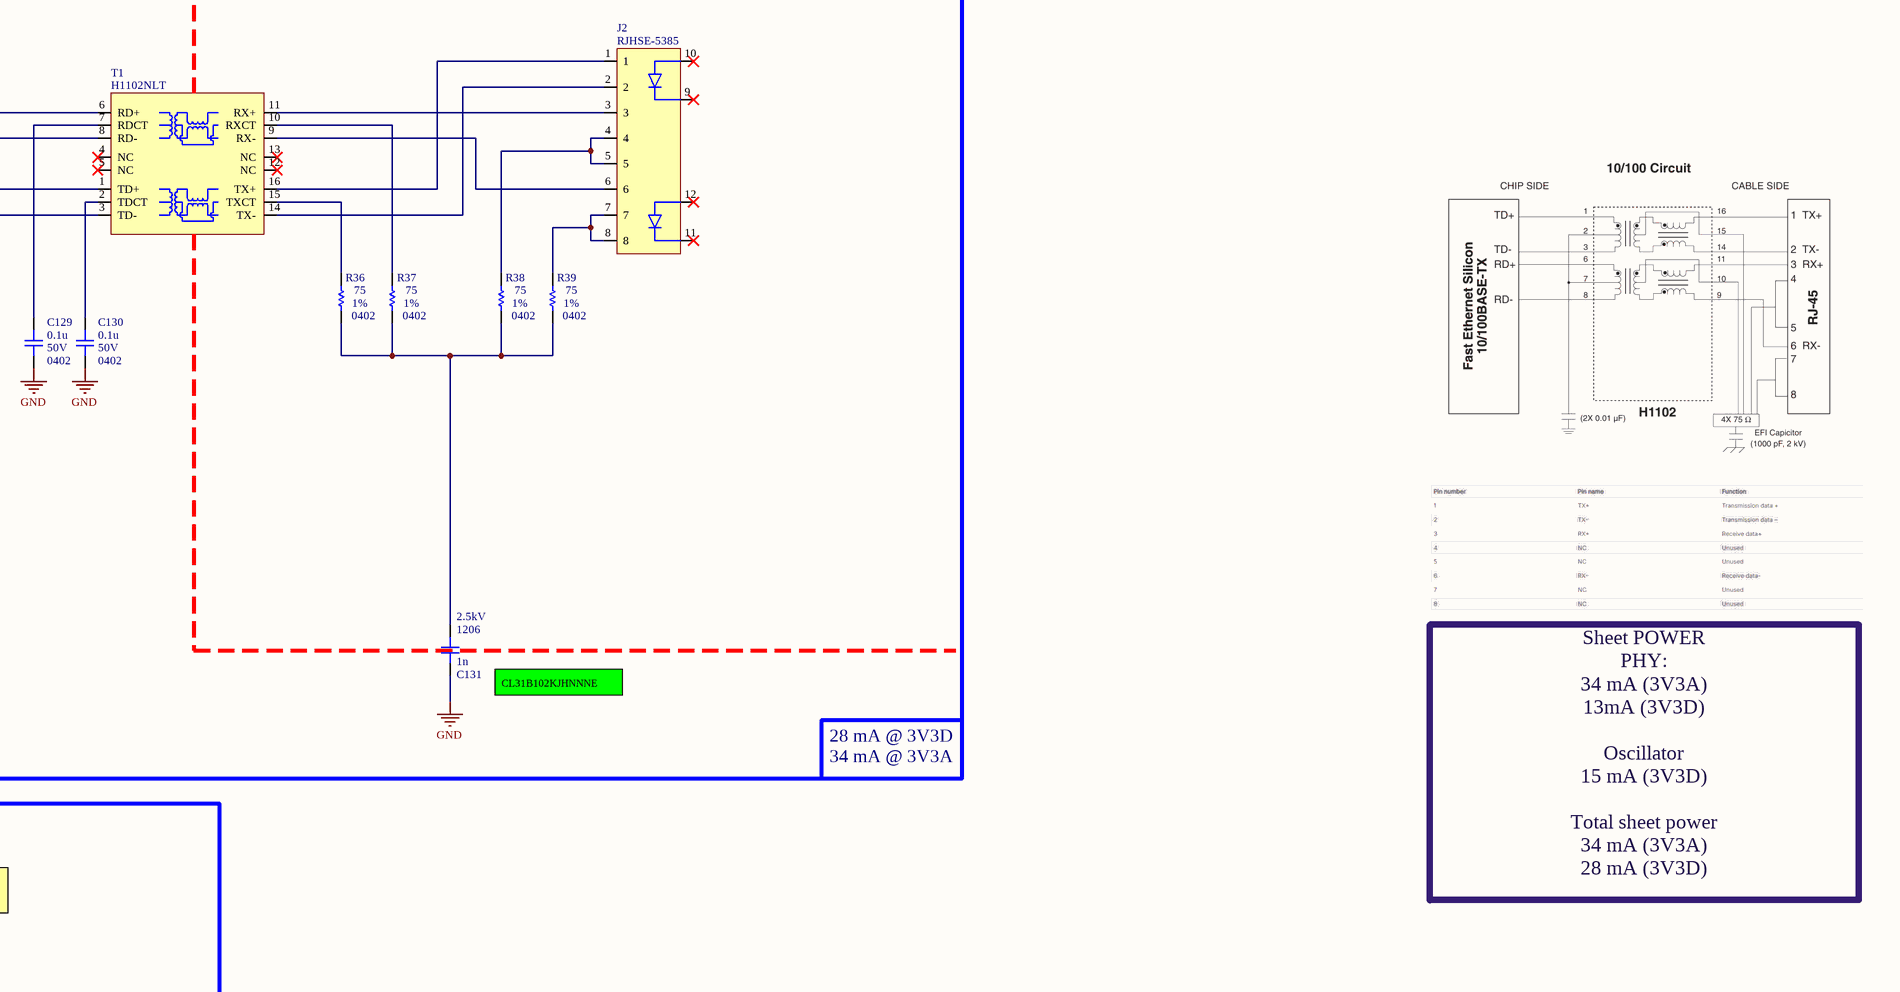
[diagram p33: S7CAS-PLEIADES-CARTE-MERE_P06_ETHERNET.SCHDOC, bottom right]

### Parts
C129  value 0.1u  Voltage: 50V  Package: 0402  [CAP_0402]  (hidden comment: CAP - 0402)
C130  value 0.1u  Voltage: 50V  Package: 0402  [CAP_0402]  (hidden comment: CAP - 0402)
C131  value 1n  Voltage: 2.5kV  Package: 1206  [CAP_0402]  (hidden comment: CAP - 0402)
C132  value 2.2uF  Voltage: 50V  Package: 0603  [CAP_0603]  (hidden comment: CAP - 0603)
C133  value 0.1uF  Voltage: 50V  Package: 0402  [CAP_0402]  (hidden comment: CAP - 0402)
C134  value 22uF  Voltage: 50V  Package: 0805  [CAP_0805]  (hidden comment: CAP - 0805)
C135  value 0.1uF  Voltage: 50V  Package: 0402  [CAP_0402]  (hidden comment: CAP - 0402)
C136  value 22uF  Voltage: 50V  Package: 0805  [CAP_0805]  (hidden comment: CAP - 0805)
C137  value 0.1uF  Voltage: 50V  Package: 0402  [CAP_0402]  (hidden comment: CAP - 0402)
J2  RJHSE-5385  [CONN_ETHERNET_RJHSE-5385]
L3  value 100R  Current: 1A  Package: 0402  [FER_0402]  (hidden comment: FER - 0402)
R34  value 1k  Package: 0402  Precision: 1%  [RES_0402]  (hidden comment: RES - 0402)
R35  value 1k  Package: 0402  Precision: 1%  [RES_0402]  (hidden comment: RES - 0402)
R36  value 75  Package: 0402  Precision: 1%  [RES_0402]  (hidden comment: RES - 0402)
R37  value 75  Package: 0402  Precision: 1%  [RES_0402]  (hidden comment: RES - 0402)
R38  value 75  Package: 0402  Precision: 1%  [RES_0402]  (hidden comment: RES - 0402)
R39  value 75  Package: 0402  Precision: 1%  [RES_0402]  (hidden comment: RES - 0402)
R40  value 6.49k  Package: 0805  Precision: 1%  [RES_0805]  (hidden comment: RES - 0805)
T1  H1102NLT  [TRANSFO_H1102NLT]
U15  KSZ8091MNXCA  [COM_ETH_PHY_KSZ8091MNXCA]
Y2  ASDMB-25.000MHZ-LC-T  [OSC_ASDMB-25.000MHZ-LC-T]

### Blocks framed on the sheet
Ethernet: C129-C131 J2 R34-R40 T1 U15 Y2
Découplage Ethernet et filtres: C132-C137 L3

### Ports
ETH_COL (out, see S7CAS-PLEIADES-CARTE-MERE_P06_FPGA3[1A]), ETH_CRS (out, see S7CAS-PLEIADES-CARTE-MERE_P06_FPGA3[1A]), ETH_INTRP (bidir, see S7CAS-PLEIADES-CARTE-MERE_P06_FPGA3[1B]), ETH_MDC (in, see S7CAS-PLEIADES-CARTE-MERE_P06_FPGA3[1A]), ETH_MDIO (bidir, see S7CAS-PLEIADES-CARTE-MERE_P06_FPGA3[1A]), ETH_Reset (in, see S7CAS-PLEIADES-CARTE-MERE_P06_FPGA3[1A]), ETH_RXC (out, see S7CAS-PLEIADES-CARTE-MERE_P06_FPGA3[1B]), ETH_RXD0 (out, see S7CAS-PLEIADES-CARTE-MERE_P06_FPGA3[1B]), ETH_RXD1 (out, see S7CAS-PLEIADES-CARTE-MERE_P06_FPGA3[1B]), ETH_RXD2 (out, see S7CAS-PLEIADES-CARTE-MERE_P06_FPGA3[1B]), ETH_RXD3 (out, see S7CAS-PLEIADES-CARTE-MERE_P06_FPGA3[1B]), ETH_RXDV (out, see S7CAS-PLEIADES-CARTE-MERE_P06_FPGA3[1B]), ETH_RXER (out, see S7CAS-PLEIADES-CARTE-MERE_P06_FPGA3[1B]), ETH_TXC (in, see S7CAS-PLEIADES-CARTE-MERE_P06_FPGA3[1B]), ETH_TXD0 (in, see S7CAS-PLEIADES-CARTE-MERE_P06_FPGA3[1B]), ETH_TXD1 (in, see S7CAS-PLEIADES-CARTE-MERE_P06_FPGA3[1B]), ETH_TXD2 (in, see S7CAS-PLEIADES-CARTE-MERE_P06_FPGA3[1B]), ETH_TXD3 (in, see S7CAS-PLEIADES-CARTE-MERE_P06_FPGA3[1B]), ETH_TXEN (in, see S7CAS-PLEIADES-CARTE-MERE_P06_FPGA3[1B]), ETH_TXER (in, see S7CAS-PLEIADES-CARTE-MERE_P06_FPGA3[1B])

### Nets
1V2D: C132.2 C133.2 U15.2(VDD_1)
3V3: Y2.4(VDD)
3V3D: C134.2 C135.2 L3.2 R34.2 R35.2 U15.17(VDDIO)
GND: C129.1 C130.1 C131.2 C132.1 C133.1 C134.1 C135.1 C136.1 C137.1 R40.1 U15.1(GND) U15.33(GND) U15.34(GND) U15.35(GND) U15.36(GND) U15.37(GND) U15.38(GND) U15.39(GND) U15.40(GND) U15.41(GND) U15.42(GND) Y2.2(GND)
ETH_COL: U15.28(COL/CONFIG0) ; port ETH_COL
ETH_CRS: U15.29(CRS/CONFIG1) ; port ETH_CRS
ETH_INTRP: R35.1 U15.21(INTRP/PME_N2/NAND_TREE#) ; port ETH_INTRP
ETH_MDC: U15.12(MDC) ; port ETH_MDC
ETH_MDIO: R34.1 U15.11(MDIO) ; port ETH_MDIO
ETH_Reset: U15.32(~{RST}) ; port ETH_Reset
ETH_RXC: U15.19(RXC/B-CAST_OFF) ; port ETH_RXC
ETH_RXD0: U15.16(RXD0/DUPLEX) ; port ETH_RXD0
ETH_RXD1: U15.15(RXD1/PHYAD2) ; port ETH_RXD1
ETH_RXD2: U15.14(RXD2/PHYAD1) ; port ETH_RXD2
ETH_RXD3: U15.13(RXD3/PHYAD0) ; port ETH_RXD3
ETH_RXDV: U15.18(RXDV/CONGIG2) ; port ETH_RXDV
ETH_RXER: U15.20(RXER/ISO) ; port ETH_RXER
ETH_TXC: U15.22(TXC/PME_EN) ; port ETH_TXC
ETH_TXD0: U15.24(TXD0) ; port ETH_TXD0
ETH_TXD1: U15.25(TXD1) ; port ETH_TXD1
ETH_TXD2: U15.26(TXD2) ; port ETH_TXD2
ETH_TXD3: U15.27(TXD3) ; port ETH_TXD3
ETH_TXEN: U15.23(TXEN) ; port ETH_TXEN
ETH_TXER: U15.31(TXER) ; port ETH_TXER
VDD_A: C136.2 C137.2 L3.1 U15.3(VDDA_3)
NetC129_2: C129.2 T1.7(RDCT)
NetC130_2: C130.2 T1.2(TDCT)
NetC131_1: C131.1 R36.1 R37.1 R38.1 R39.1
NetJ2_1: J2.1 T1.16(TX+)
NetJ2_2: J2.2 T1.14(TX-)
NetJ2_3: J2.3 T1.11(RX+)
NetJ2_4: J2.4 J2.5 R38.2
NetJ2_6: J2.6 T1.9(RX-)
NetJ2_7: J2.7 J2.8 R39.2
NetR36_2: R36.2 T1.15(TXCT)
NetR37_2: R37.2 T1.10(RXCT)
NetR40_2: R40.2 U15.10(REXT)
NetT1_1: T1.1(TD+) U15.7(TXP)
NetT1_3: T1.3(TD-) U15.6(TXM)
NetT1_6: T1.6(RD+) U15.5(RXP)
NetT1_8: T1.8(RD-) U15.4(RXM)
NetU15_9: U15.9(XI) Y2.3(OUTPUT)

Not connected (* = marked no-connect by the designer): J2 9(LED1_K)* 10(LED1_A)* 11(LED2_K)* 12(LED2_A)*; T1 4(NC)* 5(NC)* 12(NC)* 13(NC)*; U15 8(XO)* 30(LED0/PME_N1/NWAYEN)*; Y2 1(Standby)*

### Notes on the sheet
- (near C131) CL31B102KJHNNNE
- 28 mA @ 3V3D
  34 mA @ 3V3A
- L filter & bulk capacitor
- Sheet POWER
  PHY:
  34 mA (3V3A)
  13mA (3V3D)
  Oscillator
  15 mA (3V3D)
  Total sheet power
  34 mA (3V3A)
  28 mA (3V3D)
- Sheet Name
- Project Title
- Global Project
- Size
- Group
- Revision
- Date
- Sheet
- of
- Filename
- Designers

### Library data of the parts
C129-C131 C133 C135 C137 = CAP - 0402: Precision: 10%; Current: *; CreatedBy: Jonathan Bouchard; Power: *
C132 = CAP - 0603: Precision: 10%; Current: *; CreatedBy: Jonathan Bouchard; Power: *
C134 C136 = CAP - 0805: Precision: 10%; Current: *; CreatedBy: Jonathan Bouchard; Power: *
J2 = CONN_ETHERNET_RJHSE-5385: CONN - MOD JACK RJ45 R/A ETHERNET - TH; Mfg: Amphenol; Voltage: *; Current: *; Power: *; Mfg Part Number: RJHSE-5385; HelpURL: https://www.amphenolcanada.com/ProductSearch/drawings/AC/RJHSE538X.pdf; CreatedBy: Jonathan Bouchard; Temperature: -55°C ~ 85°C; Value: *; Precision: *; Package: TH-12; Supplier 1: Digikey; Supplier Part Number 1: RJHSE-5385-ND
R34-R39 = RES - 0402: Voltage: 50V; Power: 1/16W; Current: *; CreatedBy: Jonathan Bouchard
T1 = TRANSFO_H1102NLT: TRANSFO - ETHERNET 10/100B-TX - SMD-16; Mfg: Pulse Eng.; Value: 1:1 (350uH); Voltage: *; Current: *; Power: *; Mfg Part Number: H1102NLT; HelpURL: http://media.digikey.com/pdf/Data%20Sheets/Pulse%20PDFs/10_100BASE-T%20Single%20Port%20SMD%20Magnetics_Rev2008.pdf; CreatedBy: Jonathan Bouchard; Temperature: -40°C to 85°C; Precision: *; Package: SMD-16; Supplier 1: Digikey; Supplier Part Number 1: 553-1532-1-ND
U15 = COM_ETH_PHY_KSZ8091MNXCA: COM - ETHERNET PHY 10/100 - QFN-32; Voltage: 1.8V, 2.5V, 3.3V; Mfg: Micrel; Current: *; Power: *; Mfg Part Number: KSZ8091MNXCA; HelpURL: http://ww1.microchip.com/downloads/en/DeviceDoc/00002275A.pdf; CreatedBy: Jonathan Bouchard; Temperature: 0°C ~ 70°C; Value: *; Precision: *; Package: QFN-32; Supplier 1: Digikey; Supplier Part Number 1: 576-4356-ND
Y2 = OSC_ASDMB-25.000MHZ-LC-T: OSC - 25MHz XO (Standard) LVCMOS - 4-SMD, No Lead; Manufacturer #1: Abracon LLC; Tolerance: ±50ppm; Voltage Rating: 1.8V ~ 3.3V; GRAMS Lib Spec: 2.8; Magnetic Material: Unknown; Polarized: Yes; Value: 25MHz; Current Rating: *; Power Max: *; HelpURL: https://abracon.com/Oscillators/ASDMB.pdf; CreatedBy/Date: Joël Lemay 2019-03-29; VerifiedBy: C. Paulin - 29 mai 2019; Temperature: -40°C ~ +85°C; Package: 4-SMD, No Lead; Manufacturer #2: *; Note: *; Assembly Type: SMD; Part Number #2: *; Part Number #1: ASDMB-25.000MHZ-LC-T; Supplier 1: Digi-Key; Supplier Part Number 1: 535-11730-1-ND; Cryo: UNKNOWN
L3 = FER - 0402: Voltage: *; CreatedBy: Jonathan Bouchard; Power: *; Precision: *
R40 = RES - 0805: Current: *; CreatedBy: Jonathan Bouchard